# EAGLE design FoneAstra (EAGLE 7.2.0)
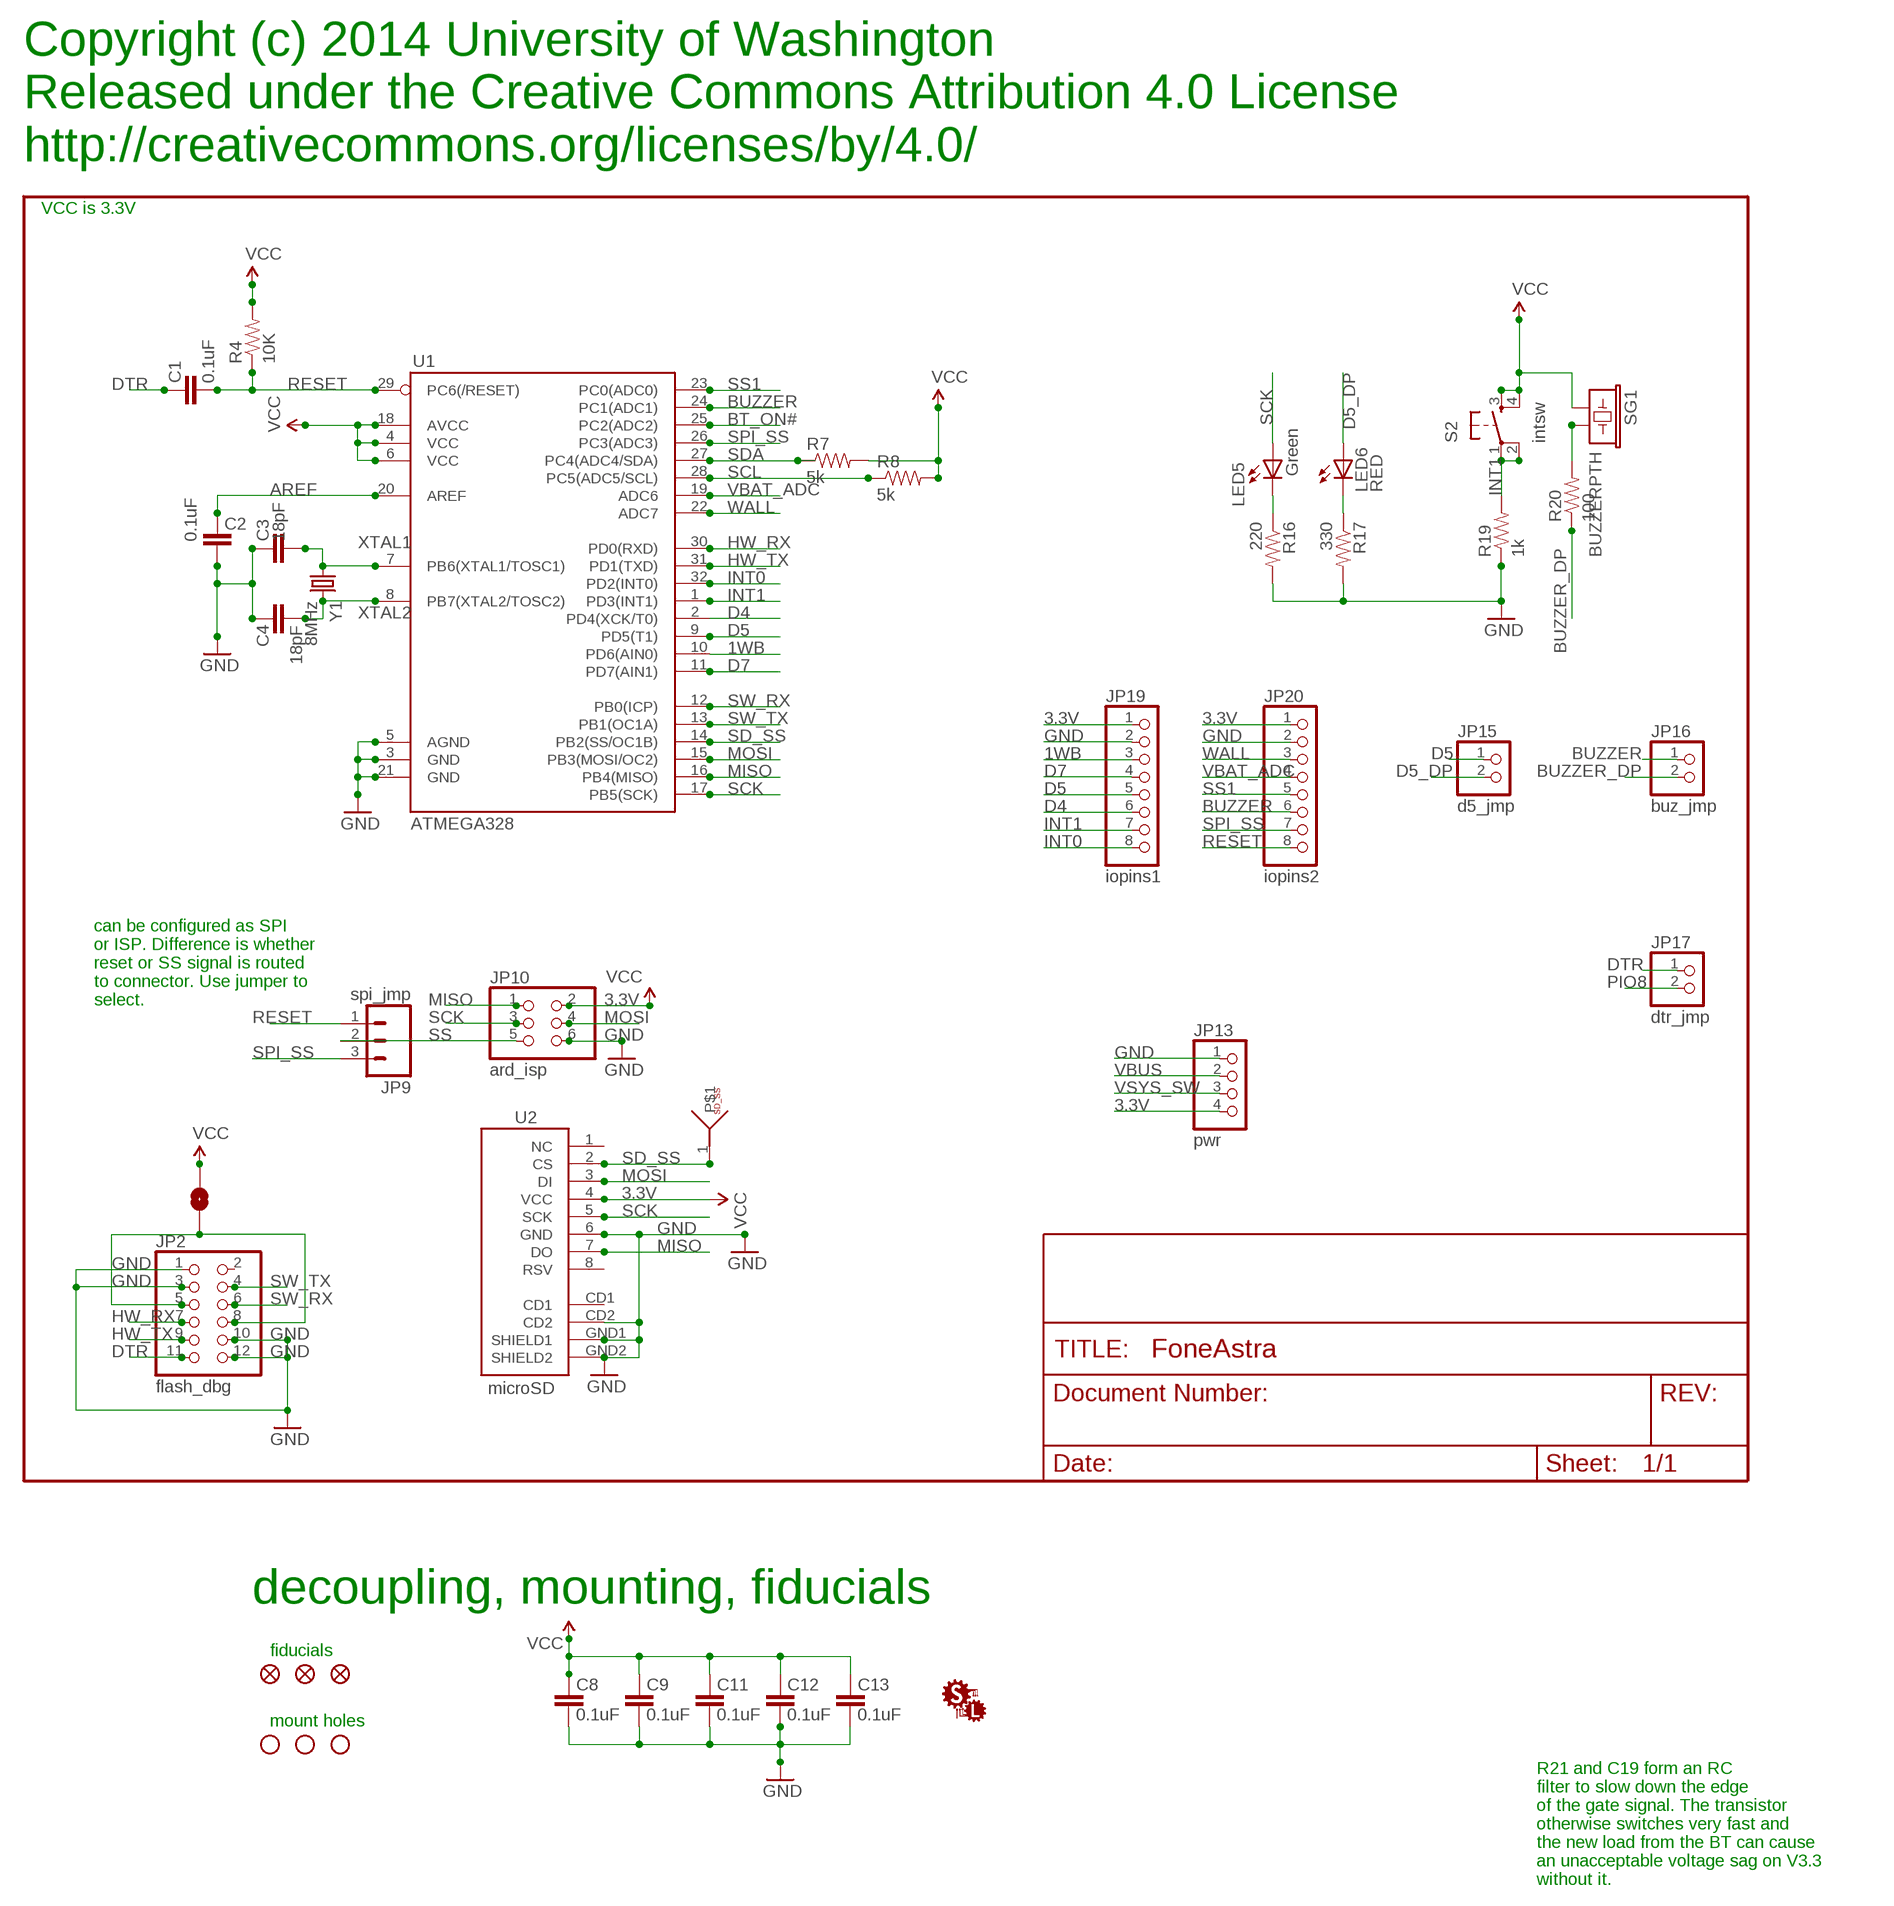
[diagram p0: schematic, sheet 1, part 1 of 2]
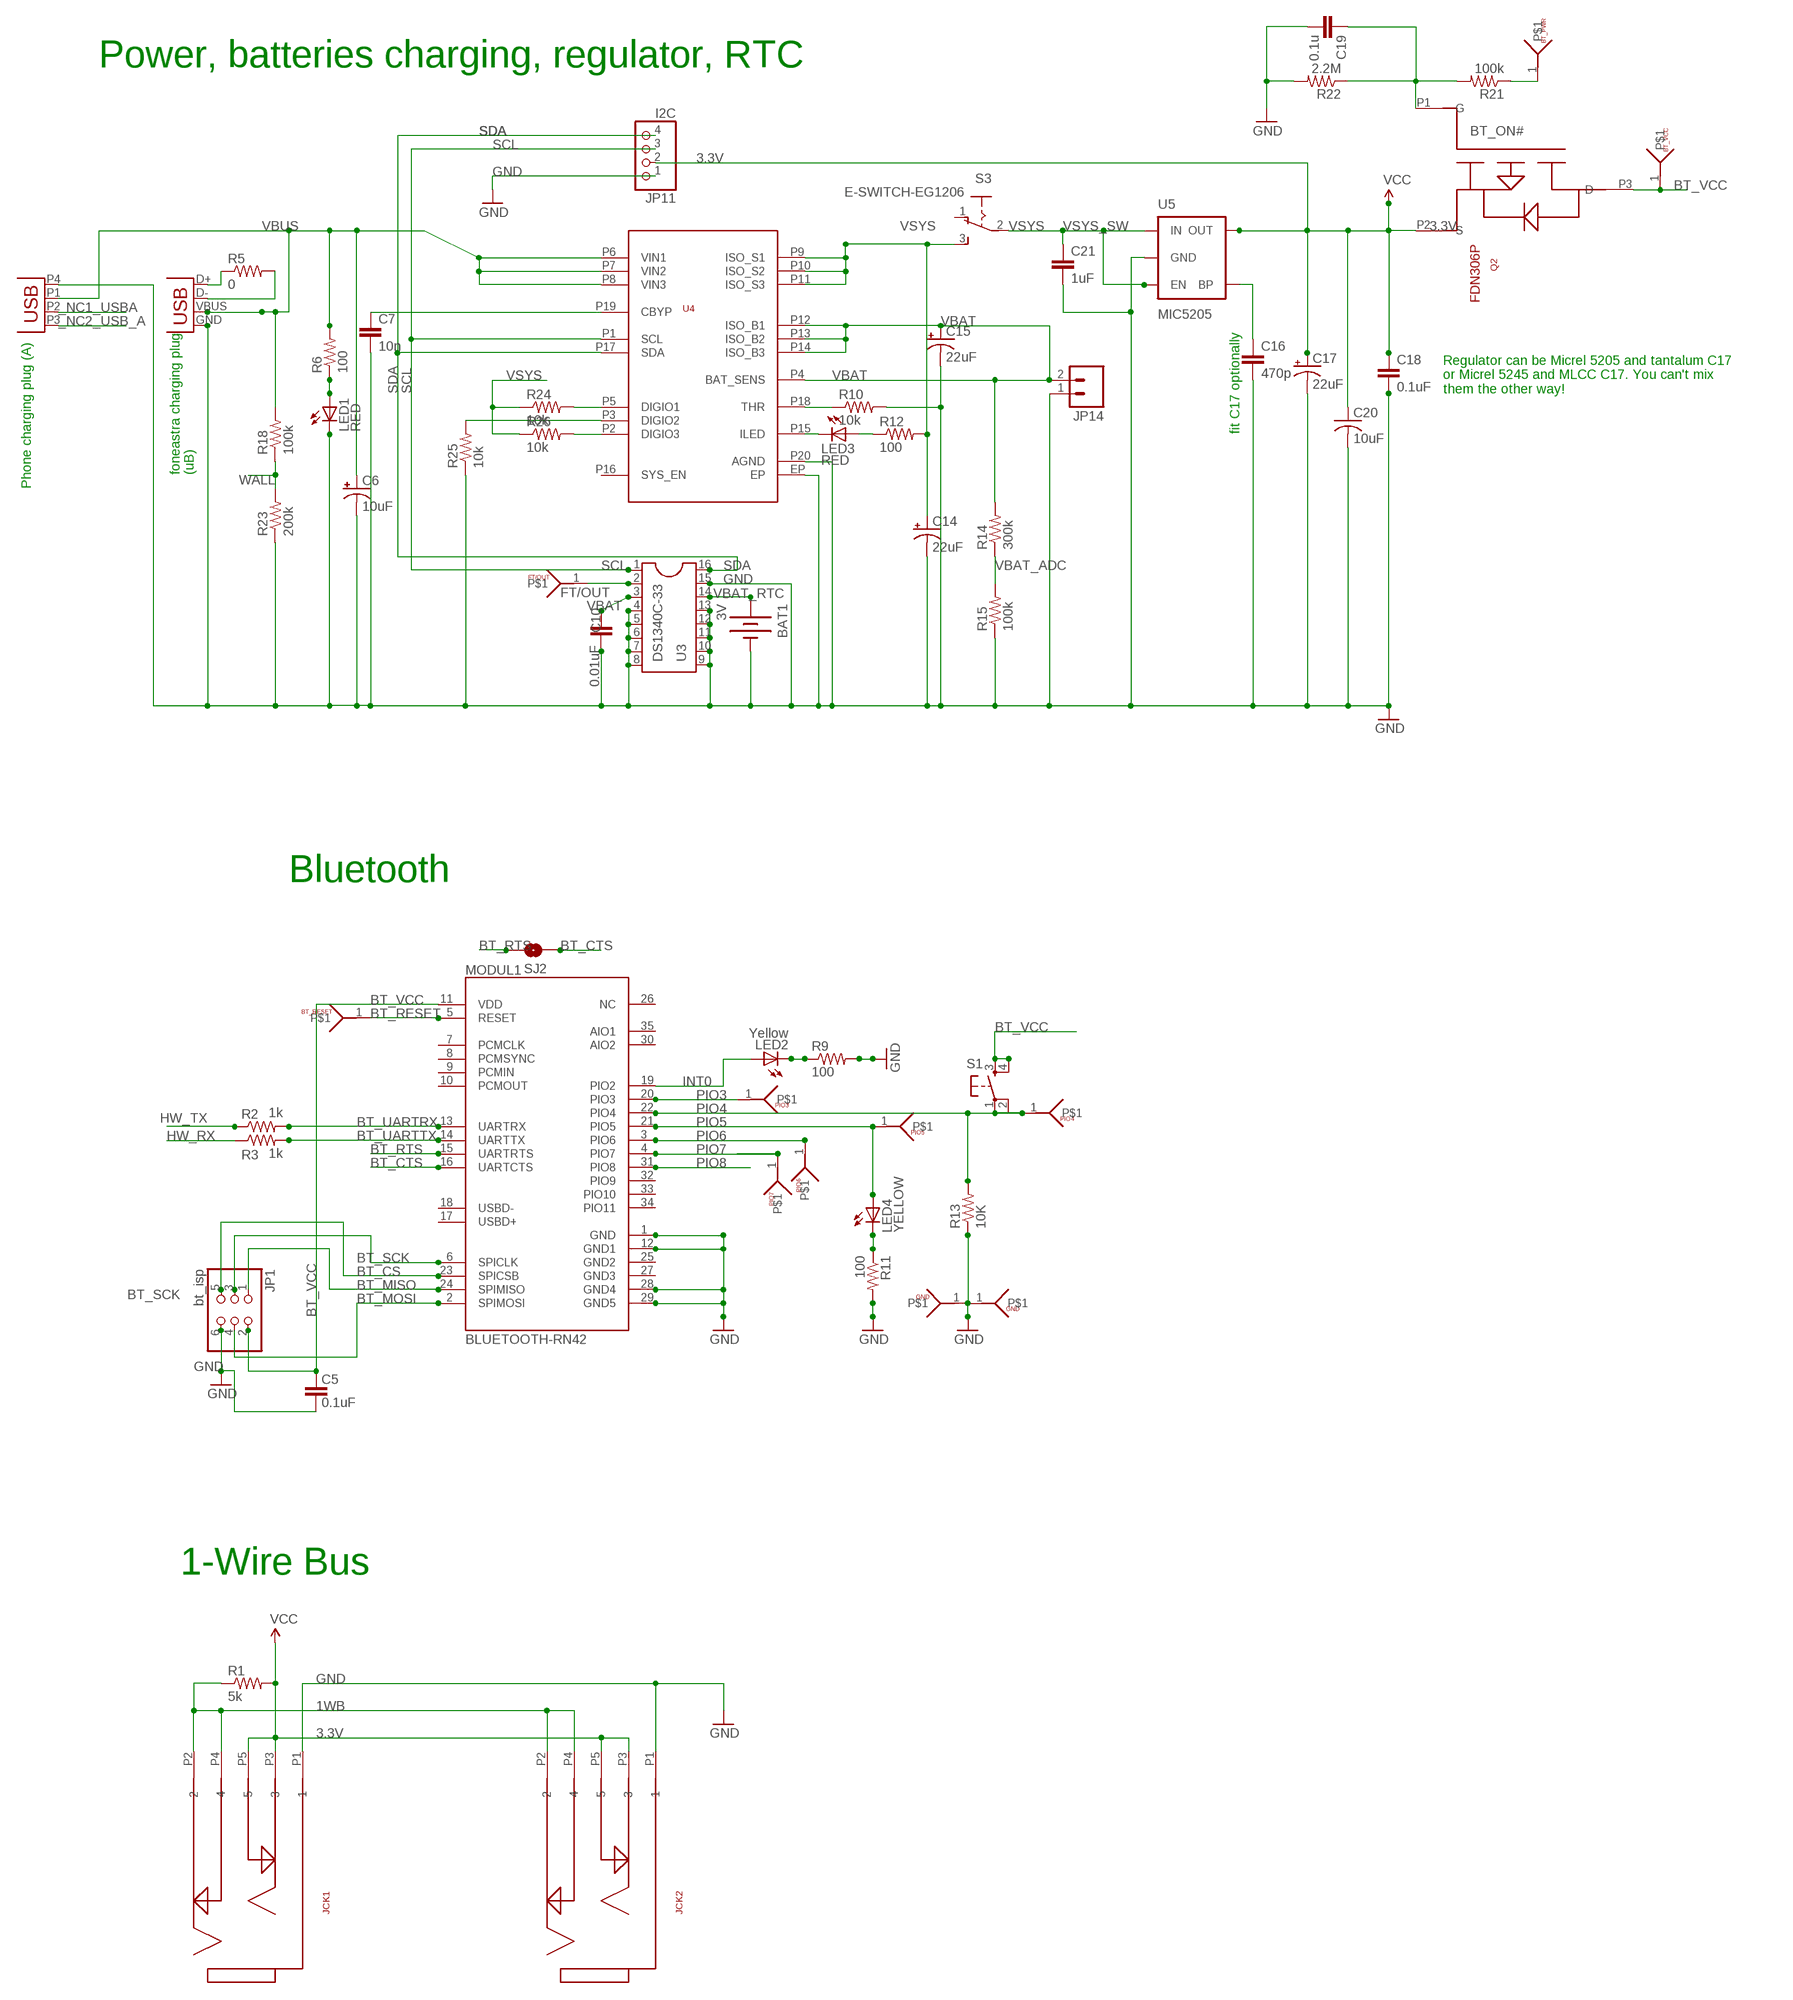
[diagram p1: schematic, sheet 1, part 2 of 2]

## Parts
BAT1  3V  BATTERY  [BATTCON_12MM_CURVED]
C1  0.1uF  CAP0402-CAP  [0402-CAP]
C2  0.1uF  CAP0402-CAP  [0402-CAP]
C3  18pF  CAP0402-CAP  [0402-CAP]
C4  18pF  CAP0402-CAP  [0402-CAP]
C5  0.1uF  CAP0402-CAP  [0402-CAP]
C6  10uF  CAP_POL1206  [EIA3216]
C7  10n  CAP0402-CAP  [0402-CAP]
C8  0.1uF  CAP0402-CAP  [0402-CAP]
C9  0.1uF  CAP0402-CAP  [0402-CAP]
C10  0.01uF  CAP0402-CAP  [0402-CAP]
C11  0.1uF  CAP0402-CAP  [0402-CAP]
C12  0.1uF  CAP0402-CAP  [0402-CAP]
C13  0.1uF  CAP0402-CAP  [0402-CAP]
C14  22uF  CAP_POL1206  [EIA3216]
C15  22uF  CAP_POL1206  [EIA3216]
C16  470p  CAP0402-CAP  [0402-CAP]
C17  22uF  CAP_POL1206  [EIA3216]
C18  0.1uF  CAP0402-CAP  [0402-CAP]
C19  0.1u  CAP0402-CAP  [0402-CAP]
C20  10uF  C-USC0805  [C0805]
C21  1uF  CAP0402-CAP  [0402-CAP]
JCK1  35RASMT4BHNTRX  [35RASMT4BHNTRX]
JCK2  35RASMT4BHNTRX  [35RASMT4BHNTRX]
JP1  bt_isp  PINHD-2X3  [2X03]
JP2  flash_dbg  PINHD-2X6  [2X06]
JP3  SPARKFUN_FIDUCIAL1.5X3  [SPARKFUN_FIDUCIAL-1.5X3]
JP4  STAND-OFFTIGHT  [STAND-OFF-TIGHT]
JP5  SPARKFUN_FIDUCIAL1.5X3  [SPARKFUN_FIDUCIAL-1.5X3]
JP6  STAND-OFFTIGHT  [STAND-OFF-TIGHT]
JP7  SPARKFUN_FIDUCIAL1.5X3  [SPARKFUN_FIDUCIAL-1.5X3]
JP8  STAND-OFFTIGHT  [STAND-OFF-TIGHT]
JP9  spi_jmp  M03PTH  [1X03]
JP10  ard_isp  PINHD-2X3  [2X03]
JP11  I2C  PINHD-1X4  [1X04]
JP13  pwr  PINHD-1X4  [1X04]
JP14  SPARKFUN_M02JST-PTH-2  [SPARKFUN_JST-2-PTH]
JP15  d5_jmp  PINHD-1X2  [1X02]
JP16  buz_jmp  PINHD-1X2  [1X02]
JP17  dtr_jmp  PINHD-1X2  [1X02]
JP19  iopins1  PINHD-1X8  [1X08]
JP20  iopins2  PINHD-1X8  [1X08]
LED1  RED  LED  [LXH4]
LED2  Yellow  LED  [LXH4]
LED3  RED  LED  [LXH4]
LED4  YELLOW  LED0603  [LED-0603]
LED5  Green  LED0603  [LED-0603]
LED6  RED  LED  [LXH4]
MODUL1  BLUETOOTH-RN42  SPARKFUN_BLUETOOTH-RN41"  [SPARKFUN_RN41]
Q2  FDN306P  [MYSOT23]
R1  5k  RESISTOR0402-RES  [0402-RES]
R2  1k  RESISTOR0402-RES  [0402-RES]
R3  1k  RESISTOR0402-RES  [0402-RES]
R4  10K  RESISTOR0402-RES  [0402-RES]
R5  0  RESISTOR0402-RES  [0402-RES]
R6  100  RESISTOR0402-RES  [0402-RES]
R7  5k  RESISTOR0402-RES  [0402-RES]
R8  5k  RESISTOR0402-RES  [0402-RES]
R9  100  RESISTOR0402-RES  [0402-RES]
R10  10k  RESISTOR0402-RES  [0402-RES]
R11  100  RESISTOR0402-RES  [0402-RES]
R12  100  RESISTOR0402-RES  [0402-RES]
R13  10K  RESISTOR0402-RES  [0402-RES]
R14  300k  RESISTOR0402-RES  [0402-RES]
R15  100k  RESISTOR0402-RES  [0402-RES]
R16  220  RESISTOR0402-RES  [0402-RES]
R17  330  RESISTOR0402-RES  [0402-RES]
R18  100k  RESISTOR0402-RES  [0402-RES]
R19  1k  RESISTOR0402-RES  [0402-RES]
R20  100  RESISTOR0402-RES  [0402-RES]
R21  100k  RESISTOR0402-RES  [0402-RES]
R22  2.2M  RESISTOR0402-RES  [0402-RES]
R23  200k  RESISTOR0402-RES  [0402-RES]
R24  10k  RESISTOR0402-RES  [0402-RES]
R25  10k  RESISTOR0402-RES  [0402-RES]
R26  10k  RESISTOR0402-RES  [0402-RES]
S1  Reset  TAC_SWITCHSMD  [TACTILE_SWITCH_SMD]
S2  intsw  SPARKFUN_TAC_SWITCHSMD  [SPARKFUN_TACTILE_SWITCH_SMD]
S3  E-SWITCH-EG1206  [EG1206]
SG1  BUZZERPTH  [BUZZER-12MM]
SJ1  SOLDERJUMPERNC2  [SJ_2S-NOTRACE]
SJ2  SOLDERJUMPERNC2  [SJ_2S-NOTRACE]
TP1  BT_RESET  TESTPOINT  [TESTPOINT]
TP2  FT/OUT  TESTPOINT  [TESTPOINT]
TP3  SD_SS  TESTPOINT  [TESTPOINT]
TP4  PIO3  TESTPOINT  [TESTPOINT]
TP5  PIO7  TESTPOINT  [TESTPOINT]
TP6  PIO6  TESTPOINT  [TESTPOINT]
TP7  PIO5  TESTPOINT  [TESTPOINT]
TP8  GND  TESTPOINT  [TESTPOINT]
TP9  GND  TESTPOINT  [TESTPOINT]
TP10  PIO4  TESTPOINT  [TESTPOINT]
TP11  BT_PWR  TESTPOINT  [TESTPOINT]
TP12  BT_VCC  TESTPOINT  [TESTPOINT]
U1  ATMEGA328  ATMEGA168  [TQFP32-08]
U2  microSD  SPARKFUN_USD-SOCKETSMD  [SPARKFUN_MICRO-SD-SOCKET-PP]
U3  DS1340C-33  [SO16L]
U4  ADP5062  [LFCSP_WQ20]
U5  MIC5205  V_REG_LDOSMD  [SOT23-5]
U$2  SHIFT_LOGO  [SHIFT_LOGO]
X1  MOLEX48204_USB_A_VERT  [MOLEX48204_USB_A_VERT]
X2  Micro USB  USB-MICROB  [USB-MICROB]
Y1  8MHz  CRYSTALHC49S  [HC49/S]

## Nets
1WB: JCK1.P2 JCK1.P4 JCK2.P2 JCK2.P4 JP19.3 R1.1 U1.10(PD6(AIN0))
3.3V [power]: C8.2 C9.2 C11.2 C12.2 C13.2 C17.A(+) C18.1 C20.1 JCK1.P3 JCK1.P5 JCK2.P3 JCK2.P5 JP10.2 JP11.2 JP13.4 JP19.1 JP20.1 Q2.P2(S) R1.2 R4.2 R7.2 R8.2 S2.3 S2.4 SG1.+ SJ1.1 U1.4(VCC) U1.6(VCC) U1.18(AVCC) U2.4(VCC) U5.5(OUT) ; supply symbol labelled VCC
_NC1_USBA: X1.P2(D-)
_NC2_USB_A: X1.P3(D+)
AREF: C2.2 U1.20(AREF)
BT_CS: JP1.5 MODUL1.23(SPICSB)
BT_CTS: MODUL1.16(UARTCTS) SJ2.1
BT_MISO: JP1.1 MODUL1.24(SPIMISO)
BT_MOSI: JP1.4 MODUL1.2(SPIMOSI)
BT_ON#: R21.1 TP11.1 U1.25(PC2(ADC2))
BT_ON_G: C19.1 Q2.P1(G) R21.2 R22.1
BT_RESET: MODUL1.5(RESET) TP1.1
BT_RTS: MODUL1.15(UARTRTS) SJ2.2
BT_SCK: JP1.3 MODUL1.6(SPICLK)
BT_UARTRX: MODUL1.13(UARTRX) R2.2
BT_UARTTX: MODUL1.14(UARTTX) R3.2
BT_VCC [power]: C5.2 JP1.2 MODUL1.11(VDD) Q2.P3(D) S1.3 S1.4 TP12.1
BUZZER: JP16.1 JP20.6 U1.24(PC1(ADC1))
BUZZER_DP: JP16.2 R20.1
CH_L1: LED3.A R12.1
CHG_L_2: LED3.K(C) U4.P15(ILED)
CHG_THR: R10.1 U4.P18(THR)
D1: LED4.C R11.1
D4: JP19.6 U1.2(PD4(XCK/T0))
D5: JP15.1 JP19.5 U1.9(PD5(T1))
D5_DP: JP15.2 LED6.A
D7: JP19.4 U1.11(PD7(AIN1))
DTR: C1.2 JP2.11 JP17.1
FT/OUT: TP2.1 U3.2
GND [power]: BAT1.GND(-) C2.1 C3.2 C4.2 C5.1 C6.C(-) C7.2 C8.1 C9.1 C10.1 C11.1 C12.1 C13.1 C14.C(-) C15.C(-) C16.2 C17.C(-) C18.2 C19.2 C20.2 C21.2 JCK1.P1 JCK2.P1 JP1.6 JP2.1 JP2.3 JP2.10 JP2.12 JP10.6 JP11.1 JP13.1 JP14.1 JP19.2 JP20.2 LED1.K(C) MODUL1.1(GND) MODUL1.12(GND1) MODUL1.28(GND4) MODUL1.29(GND5) R9.2 R10.2 R11.2 R13.1 R15.1 R16.2 R17.2 R19.1 R22.2 R23.1 R25.1 TP8.1 TP9.1 U1.3(GND) U1.5(AGND) U1.21(GND) U2.6(GND) U2.CD2 U2.GND1(SHIELD1) U2.GND2(SHIELD2) U3.4 U3.5 U3.6 U3.7 U3.8 U3.9 U3.10 U3.11 U3.12 U3.13 U3.15 U4.EP U4.P20(AGND) U5.2(GND) X1.P4(GND) X2.GND
HW_RX: JP2.7 R3.1 U1.30(PD0(RXD))
HW_TX: JP2.9 R2.1 U1.31(PD1(TXD))
INT0: JP19.8 LED2.A MODUL1.19(PIO2) U1.32(PD2(INT0))
INT1: JP19.7 R19.2 S2.1 S2.2 U1.1(PD3(INT1))
MISO: JP10.1 U1.16(PB4(MISO)) U2.7(DO)
MOSI: JP10.4 U1.15(PB3(MOSI/OC2)) U2.3(DI)
N$1: R20.2 SG1.-
N$2: JP2.5 JP2.8 SJ1.2
N$3: C7.1 U4.P19(CBYP)
N$4: R24.2 U4.P5(DIGIO1)
N$5: LED6.K(C) R17.1
N$6: R26.2 U4.P2(DIGIO3)
N$7: LED5.C R16.1
N$8: LED2.K(C) R9.1
N$9: LED1.A R6.1
N$10: C16.1 U5.4(BP)
N$11: R25.2 U4.P3(DIGIO2)
N$14: R5.2 X2.D-
N$16: R5.1 X2.D+
PIO3: MODUL1.20(PIO3) TP4.1
PIO4: MODUL1.22(PIO4) R13.2 S1.1 S1.2 TP10.1
PIO5: LED4.A MODUL1.21(PIO5) TP7.1
PIO6: MODUL1.3(PIO6) TP6.1
PIO7: MODUL1.4(PIO7) TP5.1
PIO8: JP17.2 MODUL1.31(PIO8)
RESET: C1.1 JP9.1 JP20.8 R4.1 U1.29(PC6(/RESET))
SCK: JP10.3 LED5.A U1.17(PB5(SCK)) U2.5(SCK)
SCL: JP11.3 R8.1 U1.28(PC5(ADC5/SCL)) U3.1 U4.P1(SCL)
SD_SS: TP3.1 U1.14(PB2(SS/OC1B)) U2.2(CS)
SDA: JP11.4 R7.1 U1.27(PC4(ADC4/SDA)) U3.16 U4.P17(SDA)
SPI_SS: JP9.3 JP20.7 U1.26(PC3(ADC3))
SS: JP9.2 JP10.5
SS1: JP20.5 U1.23(PC0(ADC0))
SW_RX: JP2.6 U1.12(PB0(ICP))
SW_TX: JP2.4 U1.13(PB1(OC1A))
VBAT: C10.2 C15.A(+) JP14.2 R14.2 U3.3 U4.P4(BAT_SENS) U4.P12(ISO_B1) U4.P13(ISO_B2) U4.P14(ISO_B3)
VBAT_ADC: JP20.4 R14.1 R15.2 U1.19(ADC6)
VBAT_RTC: BAT1.PWR@1(+) U3.14
VBUS [power]: C6.A(+) JP13.2 R6.2 R18.2 U4.P6(VIN1) U4.P7(VIN2) U4.P8(VIN3) X1.P1(VBUS) X2.VBUS
VSYS [power]: C14.A(+) R12.2 R24.1 R26.1 S3.3(S) U4.P9(ISO_S1) U4.P10(ISO_S2) U4.P11(ISO_S3)
VSYS_SW [power]: C21.1 JP13.3 S3.2(P) U5.1(IN) U5.3(EN)
WALL: JP20.3 R18.1 R23.2 U1.22(ADC7)
XTAL1: C3.1 U1.7(PB6(XTAL1/TOSC1)) Y1.1
XTAL2: C4.1 U1.8(PB7(XTAL2/TOSC2)) Y1.2
Unconnected: JP2.2 MODUL1.7(PCMCLK) MODUL1.8(PCMSYNC) MODUL1.9(PCMIN) MODUL1.10(PCMOUT) MODUL1.17(USBD+) MODUL1.18(USBD-) MODUL1.25(GND2) MODUL1.26(NC) MODUL1.27(GND3) MODUL1.30(AIO2) MODUL1.32(PIO9) MODUL1.33(PIO10) MODUL1.34(PIO11) MODUL1.35(AIO1) S3.1(O) U2.1(NC) U2.8(RSV) U2.CD1 U4.P16(SYS_EN)

## Notes on the sheet
- Copyright (c) 2014 University of Washington
  Released under the Creative Commons Attribution 4.0 License
  http://creativecommons.org/licenses/by/4.0/
- VCC is 3.3V
- can be configured as SPI
  or ISP. Difference is whether
  reset or SS signal is routed 
  to connector. Use jumper to
  select.
- decoupling, mounting, fiducials
- fiducials
- mount holes
- R21 and C19 form an RC
  filter to slow down the edge
  of the gate signal. The transistor
  otherwise switches very fast and
  the new load from the BT can cause
  an unacceptable voltage sag on V3.3
  without it.
- Power, batteries charging, regulator, RTC
- Regulator can be Micrel 5205 and tantalum C17
  or Micrel 5245 and MLCC C17. You can't mix
  them the other way!
- fit C17 optionally
- foneastra charging plug
  (uB)
- Phone charging plug (A)
- Bluetooth
- 1-Wire Bus

## Library data of the parts
BAT1 = SparkFun:BATTERY: Battery Holders Various common sizes : AA, AAA, 20mm coin cell and 12mm coin cell.
C1-C5 C7-C13 C16 C18 C19 C21 = SparkFun:CAP: Capacitor Standard 0603 ceramic capacitor, and 0.1" leaded capacitor.
C6 C14 C15 C17 = SparkFun:CAP_POL: Capacitor Polarized These are standard SMD and PTH capacitors. Normally 10uF, 47uF, and 100uF in electrolytic and tantalum varieties. Always verify the external diameter of the through hole cap, it varies with capacity, voltage, and manufacturer. The EIA devices should be standard.
C20 = resistor:C-US: CAPACITOR, American symbol
JCK1 JCK2 = FoneAstra3.2c:35RASMT4BHNTRX
JP1 JP10 = pinhead:PINHD-2X3: PIN HEADER
JP2 = pinhead:PINHD-2X6: PIN HEADER
JP3 JP5 JP7 = FoneAstra3.0_v2:SPARKFUN_FIDUCIAL: Fiducial Alignment Points Various fiducial points for machine vision alignment.
JP4 JP6 JP8 = SparkFun-Electromechanical:STAND-OFF: #4 Stand Off This is the mechanical footprint for a #4 phillips button head screw. Use the keepout ring to avoid running the screw head into surrounding components. SKU : PRT-00447
JP9 = FoneAstra:M03: Header 3 Standard 3-pin 0.1" header. Use with straight break away headers (SKU : PRT-00116), right angle break away headers (PRT-00553), swiss pins (PRT-00743), machine pins (PRT-00117), and female headers (PRT-00115). Molex polarized connector foot print use with SKU : PRT-08232 with associated crimp pins and housings.
JP11 JP13 = FoneAstra:PINHD-1X4: PIN HEADER
JP14 = FoneAstra3.2c:SPARKFUN_M02: Header 2 Standard 2-pin 0.1" header. Use with straight break away headers (SKU : PRT-00116), right angle break away headers (PRT-00553), swiss pins (PRT-00743), machine pins (PRT-00117), and female headers (PRT-00115). Molex polarized connector foot print use with SKU : PRT-08233 with associated crimp pins and housings.
JP15-JP17 = FoneAstra:PINHD-1X2: PIN HEADER
JP19 JP20 = pinhead:PINHD-1X8: PIN HEADER
LED1-LED3 LED6 = FoneAstra3.2c:LED
LED4 LED5 = SparkFun:LED: LEDs Standard schematic elements and footprints for 5mm, 3mm, 1206, and 0603 sized LEDs. 5mm - Spark Fun Electronics SKU : COM-00529 (and others)
MODUL1 = FoneAstra3.2c:SPARKFUN_BLUETOOTH-RN41
Q2 = FoneAstra3.2c:FDN306P
R1-R26 = SparkFun:RESISTOR: Resistor Basic schematic elements and footprints for 0603, 1206, and PTH resistors.
S1 = SparkFun:TAC_SWITCH: Momentary Switch Button commonly used for reset or general input. Spark Fun Electronics SKU : COM-00097
S2 = FoneAstra3.2b:SPARKFUN_TAC_SWITCH: Momentary Switch Button commonly used for reset or general input. Spark Fun Electronics SKU : COM-00097
S3 = FoneAstra3.2c:E-SWITCH-EG1206
SG1 = SparkFun-Electromechanical:BUZZER: Buzzer 12mm Spark Fun Electronics SKU : Comp-Buzzer
SJ1 SJ2 = SparkFun:SOLDERJUMPER: Solder Jumper Standard SMD solder jumper. Used to automate production. Two varients : Normally Open and Normally Closed are the same, but have different paste layers. NC will have a large amount of paste and should jumper during reflow.
TP1-TP12 = FoneAstra3.0_v3:TESTPOINT
U1 = SparkFun:ATMEGA168
U2 = FoneAstra3.2c:SPARKFUN_USD-SOCKET: microSD Socket Push-push type uSD socket. Schematic element and footprint production proven. Spark Fun Electronics SKU : PRT-00127. tDoc lines correctly indicate media card edge positions when inserting (unlocked, locked, depressed).
U3 = FoneAstra3.2c:DS1340C-33
U4 = FoneAstra3.2c:ADP5062
U5 = SparkFun:V_REG_LDO: Voltage Regulator LDO Standard 150mA LDO voltage regulator in SOT-23 layout. Micrel part MIC5205. BP (by-pass) pin is used to lower output noise with 470pF cap.
U$2 = FoneAstra3.2c:SHIFT_LOGO
X1 = FoneAstra3.2c:MOLEX48204_USB_A_VERT
X2 = SparkFun:USB: USB Connectors USB-B-PTH is fully proven SKU : PRT-00139 USB-miniB is fully proven SKU : PRT-00587 USB-A-PCB is untested. USB-A-H is throughly reviewed, but untested. Spark Fun Electronics SKU : PRT-00437 USB-B-SMT is throughly reviewed, but untested. Needs silkscreen touching up. USB-A-S has not been used/tested USB-MB-H has not been used/tested
Y1 = crystal:CRYSTAL: CRYSTAL; OC_FARNELL: 1667008; OC_NEWARK: unknown

## Net classes
0 default: width 0.178 mm, clearance 0.178 mm
1 power: width 0.305 mm, clearance 0.178 mm

## Board
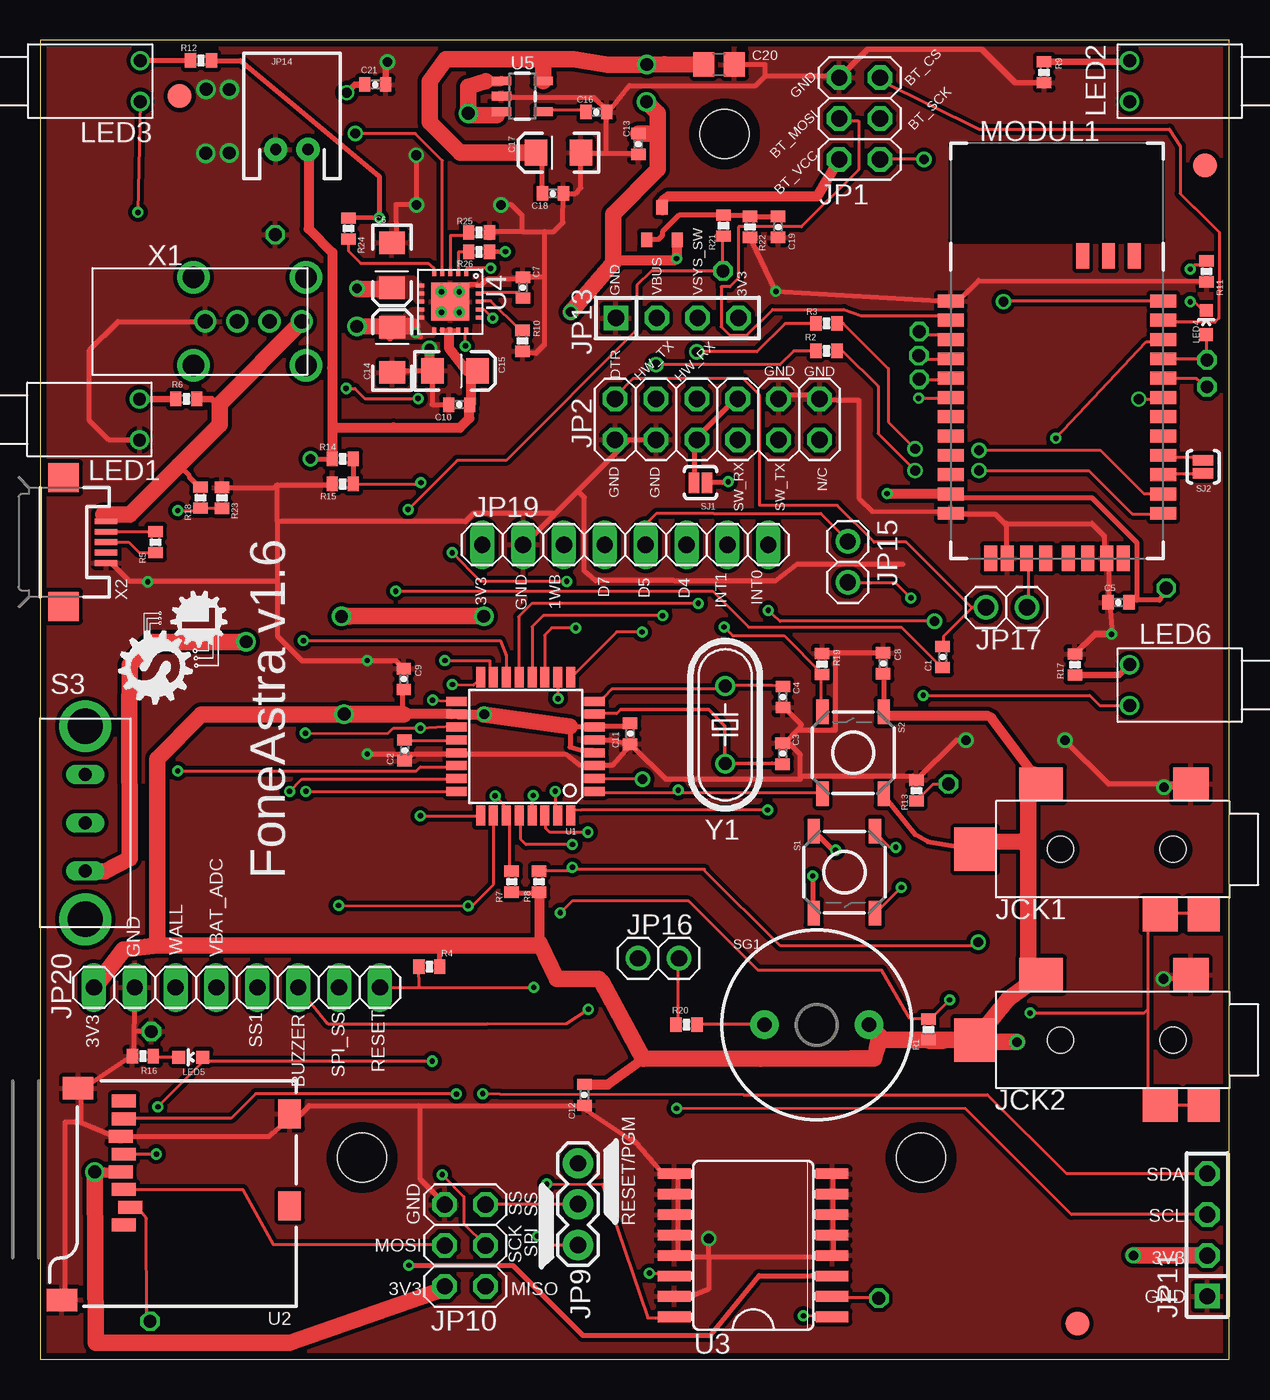
[diagram p2: board, top side]
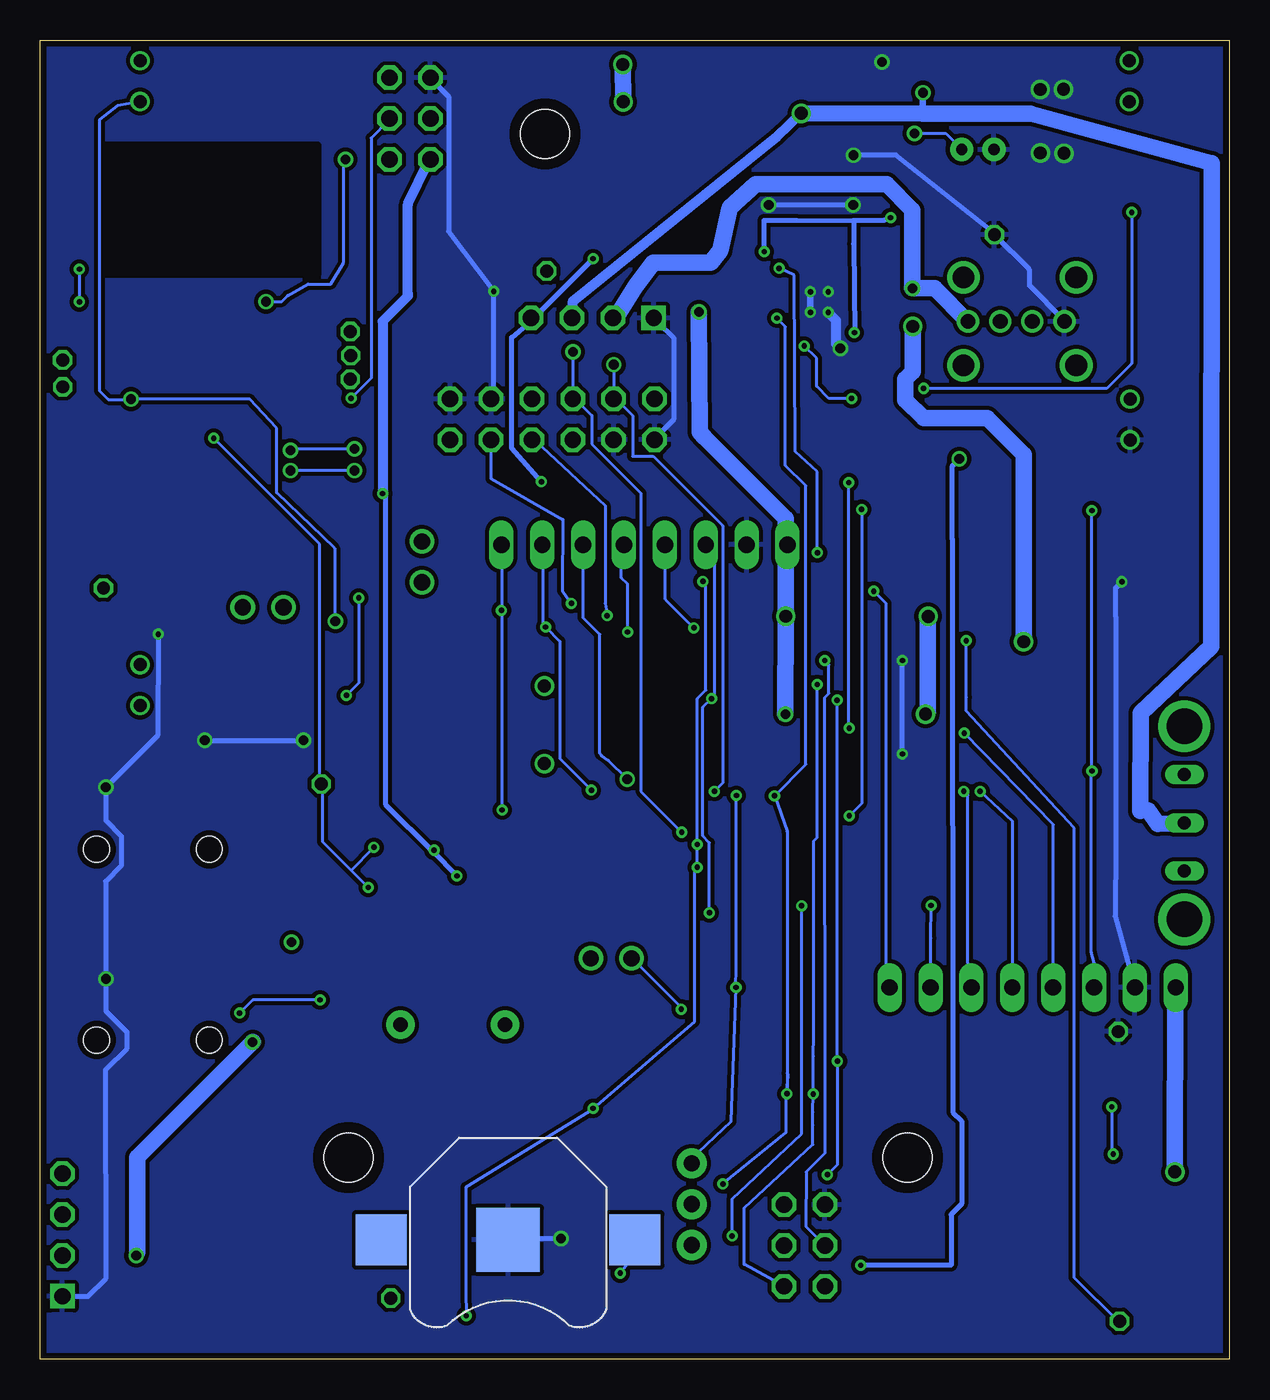
[diagram p3: board, bottom side, seen from below]

Size 73.9 x 82 mm. Coordinates in mm from the lower left corner, seen from the top.
Outline: 0,0 73.9,0 73.9,82 0,82 0,0
Copper layers (1*16): Top 0.0356mm / dielectric 1.5011mm / Bottom 0.0356mm
Design rules "LaenPCBOrder *": minimum track width 6mil, minimum drill 13mil, track to track 6mil, track to pad 6mil, pad to pad 6mil, via to via 6mil, smd to smd 6mil, copper to edge 15mil, drill to drill 6mil, minimum pad ring 7mil, minimum via ring 7mil, stop-mask expansion 3mil, vias tented up to drill 14mil, thermal gap 10mil
tRestrict: area 56.7,69.6 to 69.7,75.5
bRestrict: area 56.7,67.5 to 69.7,75.5

### Footprints (pad centres in the part's own frame; a part is rotated, then mirrored left to right if it is on the bottom)
BATTCON_12MM_CURVED = smd 3.962 x 3.962: GND 0,0 | smd 3.175 x 3.175: PWR@1 -7.874,0; PWR@2 7.874,0
0402-CAP = smd 0.7 x 0.9: 1 -0.65,0; 2 0.65,0
EIA3216 = smd 1.4 x 1.6: A 1.4,0; C -1.4,0
C0805 = smd 1.3 x 1.5: 1 -0.95,0; 2 0.95,0
35RASMT4BHNTRX = smd 2.2 x 2.1: P1 -4.5,-4.05; P2 -2.6,4.05 | smd 2.7 x 2.1: P3 4.8,-4.05 | smd 2 x 2.1: P4 -5.3,4.05 | smd 2.6 x 2.7: P5 8.9,0 | hole 1.6: -3.4,0; 3.6,0
2X03 = drill 1.016 octagon: 1 -2.54,-1.27; 2 -2.54,1.27; 3 0,-1.27; 4 0,1.27; 5 2.54,-1.27; 6 2.54,1.27
2X06 = drill 1.016 octagon: 1 -6.35,-1.27; 2 -6.35,1.27; 3 -3.81,-1.27; 4 -3.81,1.27; 5 -1.27,-1.27; 6 -1.27,1.27; 7 1.27,-1.27; 8 1.27,1.27; 9 3.81,-1.27; 10 3.81,1.27; 11 6.35,-1.27; 12 6.35,1.27
SPARKFUN_FIDUCIAL-1.5X3 = smd 1.5 x 1.5: 1 0,0
STAND-OFF-TIGHT = hole 3.048: 0,0
1X03 = drill 1.016 pad 1.88: 1 0,0; 2 2.54,0; 3 5.08,0
1X04 = drill 1.016 square: 1 -3.81,0 | drill 1.016 octagon: 2 -1.27,0; 3 1.27,0; 4 3.81,0
SPARKFUN_JST-2-PTH = drill 0.7 pad 1.448: 1 -1,0; 2 1,0
1X02 = drill 1.016: 1 -1.27,0; 2 1.27,0
1X08 = drill 1.016 long: 1 -8.89,0; 2 -6.35,0; 3 -3.81,0; 4 -1.27,0; 5 1.27,0; 6 3.81,0; 7 6.35,0; 8 8.89,0
LXH4 = drill 0.8: A -1.27,-0.73; K 1.27,-0.73
LED-0603 = smd 0.8 x 0.8: A 0,-0.75; C 0,0.75
SPARKFUN_RN41 = smd 0.8 x 1.6: 1 -6.6,-6.6; 2 -5.4,-6.6; 3 -4.2,-6.6; 4 -3,-6.6; 5 -1.8,-6.6; 6 -0.6,-6.6; 7 0.6,-6.6; 8 1.8,-6.6; 9 3,-6.6; 10 4.2,-6.6; 11 5.4,-6.6; 12 6.6,-6.6; 13 6.6,6.6; 14 5.4,6.6; 15 4.2,6.6; 16 3,6.6; 17 1.8,6.6; 18 0.6,6.6; 19 -0.6,6.6; 20 -1.8,6.6; 21 -3,6.6; 22 -4.2,6.6; 23 -5.4,6.6; 24 -6.6,6.6 | smd 1.6 x 0.8: 25 -9.4,4.8; 26 -9.4,3.2; 27 -9.4,1.6; 28 9.4,3.1; 29 9.4,-3.1; 30 9.4,-4.122; 31 9.4,-1.9; 32 9.4,-0.7; 33 9.4,0.7; 34 9.4,1.9; 35 9.4,4.122
MYSOT23 = smd 0.7 x 0.9: P1 -0.95,0; P2 0.95,0; P3 0,2
0402-RES = smd 0.7 x 0.9: 1 -0.65,0; 2 0.65,0
TACTILE_SWITCH_SMD = smd 1.524 x 0.762: 1 -2.54,1.905; 2 2.54,1.905; 3 -2.54,-1.905; 4 2.54,-1.905
SPARKFUN_TACTILE_SWITCH_SMD = smd 1.524 x 0.762: 1 -2.54,1.905; 2 2.54,1.905; 3 -2.54,-1.905; 4 2.54,-1.905
EG1206 = drill 0.8 long: 1 0,0; 2 3,0; 3 6,0 | drill 2.2 pad 2.54: P$4 -3,0; P$5 9,0
BUZZER-12MM = drill 0.9 pad 1.778: + 3.25,0; - -3.25,0
SJ_2S-NOTRACE = smd 0.635 x 1.27: 1 -0.401,0; 2 0.413,0
TESTPOINT = drill 0.8 octagon: 1 0,0
TQFP32-08 = smd 1.27 x 0.559: 1 -4.293,2.8; 2 -4.293,2; 3 -4.293,1.2; 4 -4.293,0.4; 5 -4.293,-0.4; 6 -4.293,-1.2; 7 -4.293,-2; 8 -4.293,-2.8; 17 4.293,-2.8; 18 4.293,-2; 19 4.293,-1.2; 20 4.293,-0.4; 21 4.293,0.4; 22 4.293,1.2; 23 4.293,2; 24 4.293,2.8 | smd 0.559 x 1.27: 9 -2.8,-4.293; 10 -2,-4.293; 11 -1.2,-4.293; 12 -0.4,-4.293; 13 0.4,-4.293; 14 1.2,-4.293; 15 2,-4.293; 16 2.8,-4.293; 25 2.8,4.293; 26 2,4.293; 27 1.2,4.293; 28 0.4,4.293; 29 -0.4,4.293; 30 -1.2,4.293; 31 -2,4.293; 32 -2.8,4.293
SPARKFUN_MICRO-SD-SOCKET-PP = smd 0.8 x 1.5: 1 -1.94,4.5; 2 -0.84,4.1; 3 0.26,4.5; 4 1.36,4.7; 5 2.46,4.5; 6 3.56,4.7; 7 4.66,4.5; 8 5.76,4.5 | smd 1.8 x 1.4: CD1 -0.75,-5.8; CD2 4.95,-5.8 | smd 1.4 x 1.9: GND1 -6.6,8.35; GND2 6.55,7.35
SO16L = smd 0.66 x 2.032: 1 -4.445,-4.902; 2 -3.175,-4.902; 3 -1.905,-4.902; 4 -0.635,-4.902; 5 0.635,-4.902; 6 1.905,-4.902; 7 3.175,-4.902; 8 4.445,-4.902; 9 4.445,4.902; 10 3.175,4.902; 11 1.905,4.902; 12 0.635,4.902; 13 -0.635,4.902; 14 -1.905,4.902; 15 -3.175,4.902; 16 -4.445,4.902
LFCSP_WQ20 = smd 2.35 x 2.35: EP 0,0 | smd 0.4 x 0.25: P1 -1.8,1; P2 -1.8,0.5; P3 -1.8,0; P4 -1.8,-0.5; P5 -1.8,-1; P11 1.8,-1; P12 1.8,-0.5; P13 1.8,0; P14 1.8,0.5; P15 1.8,1 | smd 0.25 x 0.4: P6 -1,-1.8; P7 -0.5,-1.8; P8 0,-1.8; P9 0.5,-1.8; P10 1,-1.8; P16 1,1.8; P17 0.5,1.8; P18 0,1.8; P19 -0.5,1.8; P20 -1,1.8
SOT23-5 = smd 0.55 x 1.2: 1 -0.95,-1.3; 2 0,-1.3; 3 0.95,-1.3; 4 0.95,1.3; 5 -0.95,1.3
MOLEX48204_USB_A_VERT = drill 1.35: MT2 2.735,-0.73; MT3 2.735,6.27; MT4 -2.735,6.27; PT1 -2.735,-0.73 | drill 0.92: P1 0,6; P2 0,4; P3 0,2; P4 0,0
USB-MICROB = smd 0.35 x 1.4: D+ 0,2.65; D- -0.65,2.65; GND 1.3,2.65; ID 0.65,2.65; VBUS -1.3,2.65 | smd 1.8 x 1.9: MT1 -4,0; MT2 4,0
HC49/S = drill 0.813: 1 -2.413,0; 2 2.413,0

### Placement (x,y rotation side)
BAT1  44.82,7.43 180 bottom
C1  56.08,43.66 90 top
C2  22.65,37.85 90 top
C3  46.13,37.65 90 top
C4  46.14,41.17 270 top
C5  67,47.05 0 top
C6  21.85,68 270 top
C7  30,66.61 90 top
C8  52.39,43.27 270 top
C9  22.59,42.28 270 top
C10  26.04,59.34 0 top
C11  36.65,38.89 90 top
C12  33.82,16.43 90 top
C13  37.17,75.55 90 top
C14  21.87,62.74 90 top
C15  25.77,61.45 0 top
C16  34.56,77.53 0 top
C17  32.2,75.01 180 top
C18  31.86,72.47 0 top
C19  45.85,70.39 270 top
C20  42.18,80.49 0 top
C21  20.82,79.25 0 top
JCK1  67,31.7 180 top
JCK2  67,19.85 180 top
JP1  50.92,77.13 90 top
JP2  42.08,58.44 180 top
JP3  8.66,78.53 0 top
JP4  42.53,76.18 0 top
JP5  64.45,2.22 0 top
JP6  20,12.54 0 top
JP7  72.39,74.22 0 top
JP8  54.74,12.54 0 top
JP9  33.42,12.18 270 top
JP10  26.41,7.08 90 top
JP11  72.52,7.73 90 top
JP13  39.59,64.73 0 top
JP14  15.64,75.2 0 top
JP15  50.19,49.57 270 top
JP16  38.42,24.92 0 top
JP17  60.04,46.74 0 top
JP19  36.35,50.64 0 top
JP20  12.22,23.11 0 top
LED1  6.9,58.42 270 top
LED2  66.97,79.46 90 top
LED3  6.95,79.46 270 top
LED4  72.46,64.46 0 top
LED5  9.36,18.77 90 top
LED6  66.97,41.91 90 top
MODUL1  63.19,59.19 270 top
Q2  38.64,69.59 0 top
R1  55.2,20.5 270 top
R2  48.87,62.69 0 top
R3  48.87,64.39 0 top
R4  24.18,24.41 0 top
R5  7.17,50.8 90 top
R6  9.08,59.69 0 top
R7  29.3,29.69 270 top
R8  31,29.69 270 top
R9  62.39,80.01 270 top
R10  29.97,63.31 270 top
R11  72.48,67.62 270 top
R12  9.99,80.74 0 top
R13  54.44,35.35 270 top
R14  18.8,55.96 180 top
R15  18.8,54.41 0 top
R16  6.38,18.84 180 top
R17  64.29,43.19 90 top
R18  9.95,53.57 90 top
R19  48.59,43.22 270 top
R20  40.16,20.8 0 top
R21  42.46,70.47 90 top
R22  44.11,70.39 270 top
R23  11.29,53.55 270 top
R24  19.15,70.29 270 top
R25  27.27,70.05 180 top
R26  27.27,68.84 180 top
S1  49.98,30.28 270 top
S2  50.52,37.7 90 top
S3  2.8,36.35 270 top
SG1  48.26,20.8 0 top
SJ1  41.03,54.5 180 top
SJ2  72.27,55.48 270 top
TP1  54.63,60.92 270 top
TP2  52.12,3.8 0 top
TP3  6.82,2.36 0 top
TP4  72.5,60.45 270 top
TP5  54.6,62.39 270 top
TP6  54.63,63.89 270 top
TP7  72.51,62.12 270 top
TP8  6.91,20.37 270 top
TP9  14.6,69.91 0 top
TP10  56.44,35.77 270 top
TP11  42.43,67.65 0 top
TP12  69.97,47.94 270 top
U1  30.16,38.1 180 top
U2  9.7,10.29 90 top
U3  44.31,7.09 90 top
U4  25.47,65.75 270 top
U5  29.96,78.51 270 top
U$2  12.45,40.15 90 top
X1  10.25,64.52 270 top
X2  1.45,50.8 270 top
Y1  42.57,39.45 90 top

### Tracks (layer width: path | path; a pad name or v marks a point on that pad's centre or on a via)
1WB  (via drill 0.33)
  Top 0.178: v32.18,41.07 32.18,42.32 U1.10 | JCK2.P4 71.65,15.82 69.16,15.82 JCK2.P2 68.83,15.91 68.83,21.75 | JCK1.P4 71.65,27.74 69.16,27.74 JCK1.P2 68.99,27.56 68.82,27.42 68.83,21.75 | 54.03,21.2 55.23,21.18 R1.1 | 54.03,21.2 53.89,21.45 52.3,24.18 44.61,24.18 40.3,28.49 33.05,28.49 v32.32,27.76 | 54.03,21.2 55.37,21.2 v56.51,22.34 | v61.51,21.52 68.6,21.52 68.83,21.75
  Bottom 0.178: JP19.3 32.54,50.49 32,49.96 32,41.25 v32.18,41.07 32.72,40.54 32.72,32.54 32.32,32.11 v32.32,27.76 | v56.51,22.34 60.69,22.34 v61.51,21.52
3.3V  (via drill 0.33, 0.6, 0.8)
  Top 0.305: C11.2 36.58,39.37 34.54,39.37 U1.6 34.31,39.29 32.93,39.29 32.93,38.05 33.6,37.87 34.31,37.87 U1.4 | 31.66,79.47 U5.5 | 30.73,75.22 C17.A | 39.37,68.33 39.61,68.5 v39.55,68.42 39.59,68.42 | 4.93,11.61 5.08,11.43 U2.4 | 3.39,11.63 3.92,11.62 | 24.95,4.31 JP10.2 | 27.69,50.55 JP19.1 | 29.21,28.96 R7.2 29.46,28.96 31.24,28.96 R8.2 31.05,28.97 | C8.2 52.45,42.49 52.45,40.36 S2.4 52.45,40.18 52.63,40.01 | S2.3 52.45,35.03 54.4,32.6 55.14,32.2 JCK1.P5 | 58.85,40.01 59.1,39.88 | 61.38,24.24 JCK2.P3 | C9.2 22.52,41.6 22.52,40.1 22.58,40.08 | 25.54,40.1 U1.18 25.96,40.08 | C18.1 31.15,72.54 31.15,74.85 30.94,74.85 C17.A | 35.63,68.22 35.6,68.33 | 3.38,23.11 JP20.1 | v42.75,54.55 42.7,54.5 SJ1.1 | R4.2 24.83,25.69 24.89,25.74 | 30.96,25.74 31.01,25.79 | 38.37,76.2 38.38,76.19 | C17.A | 31.32,80.81 31.32,80.8 | 31.26,80.7 31.15,80.8 | 57.61,19.72 57.49,19.85
  Top 0.61: 35.6,68.33 39.37,68.33 | 4.93,11.61 3.92,11.62 v3.39,11.64 | 37.56,18.72 37.49,18.68 35.27,17.09 C12.2 33.82,17.1 33.81,17.1 | 39.59,68.42 Q2.P2 | JCK2.P5 57.49,19.85 57.28,19.85 57.28,19.86 | JCK1.P5 58.07,32.16 | JCK1.P3 61.76,36.34 59.1,39.88 59.05,39.93 | 58.85,40.01 52.63,40.01 | 25.54,40.1 22.52,40.1 | 32.9,39.33 32.93,39.29 | 25.96,40.08 27.56,40.08 v27.59,40.1 | 31.05,28.97 31.05,25.87 31.01,25.79 | 34.69,23.65 34.89,23.45 | 44.73,18.71 44.79,18.69
  Top 1.016: 35.6,68.33 35.61,70.11 35.61,71.19 38.38,73.97 38.38,76.19 38.38,77.46 v37.67,78.17 | 3.39,11.63 3.45,1.02 15.49,1.02 24.95,4.31 | 37.56,18.72 44.79,18.69 50.41,18.71 51.82,18.72 51.98,19.28 52.12,19.85 52.41,19.85 | 34.89,23.45 37.49,18.68 | JCK2.P3 60.16,22.4 JCK2.P5 | 27.56,40.08 32.9,39.33 | v32.97,65.11 35.63,68.22 | 31.05,25.87 32.11,23.64 34.69,23.65 | 3.38,23.11 5.17,25.47 7.27,25.74 | 19.1,40.08 14.34,40.08 9.99,40.07 7.26,37.33 7.27,25.74 | 19.1,40.08 22.58,40.08 | 57.28,19.86 56.18,19.86 56.1,19.78 55.27,19.78 R1.2 | 57.28,19.85 52.41,19.85 | SG1.+ 51.58,20.73 51.58,20.68 52.41,19.85 | JCK1.P3 | 18.81,40.06 18.81,40.03 v18.88,40.1 | 22.52,40.1 v18.88,40.1 | 19.24,46.19 v27.57,46.19 | 19.24,46.19 18.69,46.19 | v18.88,40.1 19.08,40.1 19.1,40.08 | v18.72,46.18 19.23,46.18 19.24,46.19 | 7.27,25.74 24.89,25.74 30.96,25.74 | C13.2 38.37,76.2 | 31.32,80.8 31.15,80.8 25.19,80.8 24.2,79.46 24.2,76.9 26.09,75 C17.A | 31.32,80.81 33.16,80.81 35.23,80.48 v37.7,80.49 38.76,80.49 C20.1 | U5.5 31.26,80.7 | v60.71,19.72 57.61,19.72 | 61.38,24.24 61.38,31.86 | 61.38,31.86 61.38,36.3 61.76,36.34 | 58.07,32.16 60.92,32.19 61.38,31.86 | JP11.2 v67.93,6.46
  Bottom 0.305: v39.55,68.42 39.55,68.41 43.18,64.77 JP13.4 43.43,64.52 44.61,63.51 44.61,56.66 v42.75,54.55 | 27.56,50.67 JP19.1 27.56,50.49 | v67.93,6.46 67.86,6.64
  Bottom 0.61: 3.36,23.03 JP20.1
  Bottom 1.016: v37.67,78.17 v37.7,80.49 | v3.39,11.64 3.36,23.03 | v32.97,65.11 32.92,57.63 32.59,57.3 27.56,52.27 27.56,50.67 | 27.56,50.49 27.57,46.24 | 27.57,46.24 v27.57,46.19 | v27.57,46.19 v27.59,40.1 | v27.57,46.19 27.57,46.24 | 18.74,46.16 18.74,40.25 v18.88,40.1 | 67.86,6.64 67.86,12.57 v60.71,19.72
AREF
  Top 0.178: C2.2 22.86,38.45 25.65,38.45 U1.20
BT_CS
  Top 0.178: MODUL1.23 69.94,64.47 72.99,64.47 73.25,64.72 73.25,66.25 73.25,66.32 73.25,70.08 71.73,71.6 71.71,71.6 70.84,72.47 70.85,75.41 70.17,76.48 58.35,76.46 52.27,79.48 JP1.5 52.32,79.5
BT_CTS
  Top 0.178: SJ2.1 72.23,56.09 69.94,56.09 MODUL1.16
BT_MISO  (via drill 0.6)
  Top 0.178: MODUL1.24 59.91,65.79 v59.87,65.75 | v54.93,74.59 JP1.1
  Bottom 0.178: v59.87,65.75 58.89,65.75 58.52,66.12 58.52,66.13 57.27,66.84 55.84,66.84 55.04,68.18 55.04,74.48 v54.93,74.59
BT_MOSI
  Top 0.178: MODUL1.2 56.54,64.72 56.16,64.89 51.02,64.86 49.96,65.25 45.52,65.25 43.92,63.65 42.85,63.65 42.32,64.19 42.32,66.67 42.85,66.67 43.38,67.21 43.38,70.41 47.3,70.41 50.85,73.97 50.85,76.99 49.78,76.99 JP1.4
BT_ON#  (via drill 0.33)
  Top 0.178: R21.1 42.42,69.6 42.42,68.07 TP11.1 42.42,67.66 37.97,67.66 37.08,66.77 37.08,64.01 28.96,55.88 25.91,55.88 v22.86,52.83 | v23.62,33.78 27.18,33.78 U1.25
  Bottom 0.178: v23.62,33.78 22.86,34.54 v22.86,52.83
BT_ON_G
  Top 0.178: 42.67,71.12 R21.2 42.42,71.37 | 43.94,71.12 R22.1
  Top 0.305: R21.2 39.69,71.12 38.66,70.09 38.66,69.85 38.42,69.61 37.71,69.61 Q2.P1 | 42.67,71.12 44.11,71.12 R22.1 C19.1 | C19.1
BT_RESET
  Top 0.178: MODUL1.5 56.48,60.91 54.7,60.91 TP1.1
BT_RTS
  Top 0.178: SJ2.2 72.23,55.07 69.94,55.07 MODUL1.15
BT_SCK  (via drill 0.33)
  Top 0.178: v54.59,59.74 56.54,59.74 MODUL1.6
  Bottom 0.178: v54.59,59.74 53.34,60.98 53.34,75.92 52.27,76.99 JP1.3
BT_UARTRX  (via drill 0.6)
  Top 0.178: R2.2 49.87,62.69 52.07,60.48 52.07,57.55 v54.37,55.24 | v58.34,55.24 65.17,55.24 67.87,52.55 69.74,52.55 MODUL1.13
  Bottom 0.178: v54.37,55.24 v58.34,55.24
BT_UARTTX  (via drill 0.6)
  Top 0.178: R3.2 49.91,64.39 52.7,61.59 52.7,58.26 v54.37,56.59 | v58.34,56.52 65.88,56.52 68.58,53.82 69.76,53.82 MODUL1.14
  Bottom 0.178: v54.37,56.59 58.26,56.59 v58.34,56.52
BT_VCC  (via drill 0.33)
  Top 0.305: 49.53,74.42 JP1.2 | 68.17,47.2 69.56,47.2 TP12.1 | 68.17,47.2 67.66,47.2 C5.2 | 68.17,47.2 68.17,50.75 65.37,53.55 56.74,53.55 MODUL1.11 56.56,53.82 | Q2.P3 38.66,71.43 38.66,71.44 | v48.01,30.05 48.01,27.74 S1.4 | v49.43,31.65 49.25,31.65 48.18,32.72 S1.3
  Top 0.61: 38.66,71.41 38.66,71.44 38.66,72.02 39,72.28 48.26,72.28 49.53,74.42 | v52.63,53.82 56.56,53.82
  Bottom 0.305: 49.78,74.42 JP1.2 | 69.88,47.83 TP12.1 | 51.05,66.22 51.05,66.1 | 52.63,53.9 v52.63,53.82 52.45,53.7 52.45,34.49 49.52,31.56 | 49.52,31.56 v48.01,30.05 | v49.43,31.65 49.52,31.56
  Bottom 0.61: 49.78,74.42 51.05,71.8 51.05,66.22 | 51.05,66.1 52.63,64.53 52.63,53.9
BUZZER  (via drill 0.33)
  Top 0.178: v16.51,35.31 25.65,35.31 U1.24 | v34.07,21.76 v34.06,21.76 32.73,20.88 27.78,20.86 17.88,20.86 JP20.6
  Bottom 0.178: v16.51,35.31 16.26,35.05 16.26,24.64 JP20.6 | v34.07,21.76 34.04,21.84 37.08,24.89 JP16.1
BUZZER_DP
  Top 0.178: R20.1 39.62,20.83 39.62,24.89 JP16.2
CH_L1
  Top 0.305: R12.1 6.46,80.72 LED3.A
CHG_L_2  (via drill 0.33)
  Top 0.178: v26.42,62.99 26.42,63.75 U4.P15 | LED3.K v6.07,71.3 | v19.01,60.36 19.55,60.35 20.17,59.73 v23.48,59.73
  Bottom 0.178: v26.42,62.99 25.66,62.23 25.66,60.49 24.89,59.73 v23.48,59.73 | v6.07,71.3 6.07,71.33 6.07,61.91 7.62,60.35 v19.01,60.36
CHG_THR
  Top 0.178: U4.P18 27.43,65.79 28.01,65.79 29.79,64.01 R10.1
D1  (via drill 0.33)
  Top 0.178: v71.47,65.74 71.72,65.74 72.23,65.23 LED4.C | v71.47,67.77 71.72,68.02 72.23,68.02 R11.1
  Bottom 0.178: v71.47,67.77 v71.47,65.74
D4  (via drill 0.6)
  Top 0.178: U1.2 37.39,36.1 v37.42,36.07
  Bottom 0.178: v37.42,36.07 38.59,37.23 39.02,37.55 39.13,37.65 39.13,45.05 40.16,46.09 JP19.6
D5  (via drill 0.33)
  Top 0.178: v37.4,45.21 35.81,45.21 33.02,42.42 U1.9 | JP15.1 50.04,51.05 48.51,52.58 41.85,52.58 41.84,52.58 38.29,52.58 37.62,51.92 JP19.5
  Bottom 0.178: v37.4,45.21 37.4,48.2 37.78,48.58 37.78,50.48 JP19.5
D5_DP  (via drill 0.33)
  Top 0.178: JP15.2 53.14,48.3 v54.11,47.33 | v54.88,41.27 65.22,41.27 65.85,40.64 67.83,40.64 LED6.A
  Bottom 0.178: v54.11,47.33 54.11,42.04 v54.88,41.27
D7  (via drill 0.33)
  Top 0.178: v33.27,45.47 31.79,45.47 31.34,45.02 31.34,42.42 U1.11
  Bottom 0.178: v33.27,45.47 35.05,47.24 35.05,50.61 JP19.4
DTR
  Top 0.178: JP2.11 35.81,59.94 36.83,60.96 43.69,60.96 44.7,59.94 44.7,53.09 49.53,53.09 51.82,50.8 53.82,50.8 57.88,46.74 | JP17.1 57.88,46.74 | 57.88,46.74 57.88,46.69 56.12,44.93 56.12,44.35 C1.2
FT/OUT
  Top 0.178: U3.2 49.29,3.83 52.08,3.83 TP2.1
GND  (via drill 0.33, 0.6, 0.8)
  Top 0.305: 23.11,37.59 22.86,37.34 C2.1 | 23.11,37.59 25.65,37.59 U1.21 25.91,37.59 32.7,37.59 33.53,36.92 34.29,36.92 U1.3 34.54,36.92 35.56,36.92 36.58,38.1 C11.1 | C11.1 35.47,38.51 34.54,38.51 U1.5 | 46.1,38.35 C3.2 | 36.83,38.35 C11.1 | C4.2 46.2,40.55 47.31,39.43 46.99,39.05 | 44.2,69.85 R22.2 44.2,69.6 v45.72,66.39 56.36,65.79 MODUL1.1 | 56.48,65.74 MODUL1.1 | 60.04,51.85 59.36,52.53 56.74,52.53 MODUL1.12 56.48,52.78 56.23,52.72 51.73,52.71 50.88,53.55 50.88,59.63 49.53,59.63 48.51,59.69 JP2.1 48.26,59.94 45.97,59.94 JP2.3 | 60.04,51.85 60.04,51.96 65.36,51.96 66.14,51.18 66.14,49.99 MODUL1.28 66.39,49.74 66.39,47.2 C5.1 66.5,46.62 66.61,45.06 v66.57,45.07 66.57,45.09 66.56,45.1 | 60.04,51.85 60.04,49.99 MODUL1.29 | U3.8 49.29,11.45 49.29,10.43 U3.7 49.29,10.18 49.29,9.16 U3.6 49.29,8.91 49.29,7.89 U3.5 49.29,7.64 49.29,6.62 U3.4 49.03,6.37 41.56,6.39 | 41.56,6.39 41.54,4.35 40.56,3.94 39.57,3.94 39.64,4.08 U3.15 | 41.56,6.39 39.64,6.37 U3.13 39.64,6.62 39.64,7.64 U3.12 39.64,7.89 39.64,8.91 U3.11 39.64,9.16 39.64,10.18 U3.10 39.64,10.43 39.64,11.45 U3.9 38.67,11.55 37.08,13.4 | 16,14.73 15.75,14.99 U2.CD2 | JP10.6 25.2,9.65 25.17,9.65 23.63,11.19 23.63,15.63 23.5,15.76 | 2.52,16.76 5.59,18.8 R16.2 5.84,19.05 5.84,20.4 | 2.52,16.76 2.54,16.76 U2.GND2 | 2.52,14.73 4.32,13.97 4.83,13.97 5.08,13.72 U2.6 5.32,13.85 14.21,13.85 15.49,14.99 U2.CD2 | 2.52,16.76 2.52,14.73 | 2.52,14.73 1.52,14.73 1.52,3.56 U2.GND1 | 5.84,20.4 5.92,23.11 JP20.2 | 36.78,13.7 37.08,13.4 | 16,14.73 U2.CD2 | 35.18,74.96 33.78,74.96 C17.C 33.59,72.8 33.27,72.47 C18.2 32.48,70.66 31.91,70.1 31.32,70.1
  Top 0.305: 35.18,74.96 37.08,74.96 37.05,74.94 C13.1 | 35.18,74.96 35.16,77.42 C16.2 | U5.2 28.81,78.44 34.4,78.44 35.16,77.68 C16.2 | JP1.6 49.53,79.76 45.05,79.76 | C16.2 35.42,77.68 36.6,79.17 44.46,79.17 45.05,79.76 | 14.73,52.07 14.73,48.27 | 14.73,48.27 14.73,44.96 16.26,43.43 v20.32,43.43 22.1,43.43 22.35,43.18 C9.1 | 36.32,56.9 36.58,57.15 38.1,57.15 JP2.10 38.41,57.07 | 36.32,56.9 33.41,53.98 | 33.41,53.98 32,52.58 | 32,52.58 30.23,50.8 JP19.2 | 36.32,56.9 36.07,56.9 35.81,57.15 JP2.12 | C10.1 24.36,59.36 24.36,61.13 24.39,61.21 C15.C 24.13,61.47 22.1,61.47 C14.C | 29.94,70.1 31.32,70.1 | 29.94,70.1 27.94,70.1 R25.1 | 29.94,70.1 29.94,71.11 29.27,71.77 v28.63,71.77 | C6.C 22.1,69.6 22.13,69.61 22.1,71.79 23.28,71.77 v23.38,71.77 23.37,72.15 v23.37,74.86 | U4.EP 25.66,65.79 26.67,66.8 27.18,66.8 U4.P20 27.43,66.8 27.77,67.14 30.05,67.14 C7.2 29.98,67.31 31.32,67.31 | 14.73,52.07 26.42,52.07 26.92,52.58 32,52.58 | 46.99,39.05 46.35,38.42 45.77,38.42 C3.2 | 23.11,37.59 20.35,37.59 v20.32,37.62 | v24.93,65.09 25.15,65.28 25.4,65.53 U4.EP | v24.93,66.36 25.15,66.29 25.4,66.29 U4.EP | 47.24,36.27 47.24,36.07 38.86,36.07 36.83,38.1 C11.1 | 47.24,36.27 47.24,37.59 46.48,38.35 C3.2 | TP8.1 6.91,20.4 5.84,20.4 | R11.2 72.36,67.03 58.31,67.06 57.25,65.99 MODUL1.1 | 49.43,43.92 52.27,43.92 C8.1 | 49.43,43.92 48.72,43.92 R19.1 | 47.24,36.27 54.23,36.27 54.41,36.09 R13.1 56.91,38.47 v57.53,38.47 | 53.62,49.43 47.04,49.43 45.7,48.4 39.4,48.4 | 49.43,43.92 49.43,39.12 47.12,39.12 46.99,39.05 | 37.08,13.4 33.82,15.56 C12.1 33.8,15.76 23.5,15.76 | 41.56,6.39 41.54,7.08 v41.54,7.5 | v69.81,23.65 71.48,23.65 JCK2.P1
  Top 0.305: v69.82,35.56 71.12,35.56 JCK1.P1 66.4,35.75 v63.67,38.47 | 39.4,48.4 | 39.4,48.4 34.5,48.4 33.82,48.99 33.82,53.57 33.41,53.98 | 33.41,53.98 | 31.32,70.1 31.32,67.31 | 31.32,67.31 31.32,63.07 30.8,62.55 30.09,62.55 R10.2 | 14.73,52.07 14.73,54.37 | 14.73,54.37 14.72,54.33 17.08,54.33 18.07,54.33 R15.1 | 16,14.73 16,15.05 16.72,15.76 23.5,15.76 | 6.48,48.36 5.54,48.36 4.4,49.5 X2.GND | 6.48,48.36 6.68,48.36 | 6.68,48.36 v6.68,48.33 6.51,48.33 6.48,48.36 | R23.1 14.57,54.2 14.73,54.37 | 6.68,48.36 14.64,48.36 14.73,48.27 | LED1.K 4.27,57.15 3.06,58.36 3.06,62.72 4.84,64.51 10.24,64.51 X1.P4 | 45.05,79.76 45.05,80.49 43.03,80.49 C20.2
  Top 0.33: R9.2 60.58,79.36 58.5,81.44 51.42,81.44 JP1.6
  Top 0.406: v26.04,66.36 25.47,66.36 U4.EP | 66.57,45.09 65.55,45.09 R17.2 | C21.2 21.47,80.52 v21.59,80.64
  Top 0.61: 71.44,23.97 71.16,23.81 JCK2.P1 | v24.18,62.84 24.18,61.64 C15.C
  Bottom 0.305: JP2.3 45.72,59.94 45.72,64.26 v45.72,66.39 48.51,70.1 48.51,78.49 49.53,79.5 JP1.6 | v28.63,71.77 v23.38,71.77 | JP2.12 35.56,57.4 34.54,58.42 34.54,63.5 35.56,64.52 JP13.1 | v20.32,37.62 v20.32,43.43 | JP20.2 7.11,27.54 7.05,32.09 7.05,33.32 7.07,46.17 7.07,47.95 v6.68,48.33 | v41.54,7.5 44.3,7.5 BAT1.GND | v66.57,45.07 66.6,38.78 v69.82,35.56 69.82,33.48 68.85,32.51 68.85,30.7 69.83,29.72 v69.81,23.65 69.8,23.64 69.8,21.63 68.5,20.33 68.5,19.34 69.82,18.03 69.8,5.05 70.94,3.92 JP11.1 | v63.67,38.47 v57.53,38.47 | X1.P4 10.25,64.57 12.42,66.74 12.42,67.73 TP9.1 14.6,70 20.73,74.86 v23.37,74.86
  Bottom 0.406: v26.04,66.36 v26.04,65.09
  Bottom 0.61: v24.93,65.09 24.93,65.06 24.45,64.58 24.45,63.11 v24.18,62.84
  other vias: 11.76,78.93 10.31,78.94 11.75,74.99 10.28,74.97
  pour Top (isolate 0.254, rank 3): -3.18,-1.91 75.6,-1.91 75.6,3.66 75.57,3.66 75.57,84.2 -3.2,84.2 -3.2,-1.88
  pour Bottom (isolate 0.254, rank 3): -1.35,-0.62 76.47,-0.53 76.38,3.89 76.3,4.81 76.12,84.66 -2.88,84.57 -1.37,-0.59
HW_RX  (via drill 0.33, 0.6)
  Top 0.178: v34.04,32.77 31.66,32.77 31.42,33.01 31.42,33.78 U1.30 | R3.1 46.3,64.39 44.53,62.63 v40.8,62.63
  Bottom 0.178: v34.04,32.77 36.58,35.31 36.58,53.85 39.62,56.9 39.62,58.67 40.64,59.69 JP2.7 40.8,59.71 v40.8,62.63
HW_TX  (via drill 0.33, 0.6)
  Top 0.178: v32,35.31 32,34.04 U1.31 | R2.1 46.81,62.69 45.96,61.83 v38.26,61.83
  Bottom 0.178: v32,35.31 31.5,35.81 31.5,51.82 35.81,56.13 37.08,56.13 37.08,58.67 38.1,59.69 JP2.9 v38.26,61.83
INT0  (via drill 0.33, 0.6)
  Top 0.178: v45.2,34.15 33.61,34.15 32.94,34.12 U1.32 | v68.26,59.69 69.69,59.69 MODUL1.19 | v55.56,45.88 45.96,45.88 v45.24,46.56
  Bottom 0.178: 45.21,46.62 45.21,46.2 | 45.21,46.2 45.21,34.8 v45.2,34.15 45.34,34.14 | JP19.8 45.21,50.55 45.21,46.62 | LED2.A 69.1,77.94 70.22,77.05 70.22,60.21 69.67,59.66 68.56,59.66 68.3,59.69 | 68.3,59.69 60.88,59.68 59.21,57.87 59.21,53.87 55.6,50.43 55.6,45.92 v55.56,45.88 | 45.21,46.62 v45.24,46.56 45.32,46.31 45.21,46.2 | v68.26,59.69 68.31,59.69 68.3,59.69
INT1  (via drill 0.33)
  Top 0.178: 39.65,35.2 48.54,35.2 S2.1 | 39.65,35.2 34.49,35.2 U1.1 | S2.2 48.54,40.36 48.54,42.49 R19.2 48.54,42.67 46.23,44.98 43.03,44.98 v42.49,45.52 | v39.65,35.38 39.65,35.2
  Bottom 0.178: JP19.7 42.67,50.49 42.67,45.7 v42.49,45.52 41.6,44.63 41.6,37.34 v39.65,35.38
MISO  (via drill 0.33)
  Top 0.178: v25.62,41.95 26.92,41.91 27.18,42.16 U1.16 | v25.86,16.49 13.39,16.51 11.86,14.99 5.33,14.99 U2.7
  Bottom 0.178: v25.62,41.95 25.62,32.43 25.84,32.21 25.84,20.17 25.86,18.83 v25.86,16.49 25.88,15.36 25.88,14.55 25.89,13.35 30.16,9.4 30.16,5.89 27.74,4.57 JP10.1
MOSI  (via drill 0.33)
  Top 0.178: v25.15,43.43 27.94,43.43 27.94,42.42 U1.15 | U2.3 5.24,10.54 12.61,10.54 14.5,7.12 24.95,7.11 JP10.4
  Bottom 0.178: v25.15,43.43 24.89,43.18 24.89,41.4 25.15,41.15 25.13,12.82 26.3,11.64 26.32,8.26 JP10.4
N$1
  Top 0.178: R20.2 40.89,20.83 44.96,20.83 SG1.-
N$2
  Top 0.178: 40.64,55.12 SJ1.2 | 40.64,57.15 JP2.8 40.89,57.4 | 43.18,59.69 JP2.5
  Top 0.305: 40.64,57.15 40.64,55.12 | 40.89,57.4 43.18,59.69
N$3
  Top 0.178: U4.P19 27.43,66.29 29.72,66.29 29.98,66.04 C7.1
N$4
  Top 0.178: U4.P5 24.47,67.84 24.12,68.13 19.92,68.14 19.15,68.91 R24.2
N$5
  Top 0.178: 67.82,43.19 LED6.K
  Top 0.406: R17.1 67.05,42.54 LED6.K
N$6
  Top 0.178: U4.P2 25.99,67.56 25.99,68.83 26.42,68.83 R26.2
N$7
  Top 0.178: LED5.C 8.38,18.8 7.11,18.8 R16.1
N$8
  Top 0.406: R9.1 67.63,80.66 LED2.K
N$9
  Top 0.406: R6.1 LED1.A
N$10
  Top 0.178: C16.1 33.89,77.68 31.35,77.68 U5.4
N$11
  Top 0.178: U4.P3 25.48,67.56 25.48,69.85 26.42,69.85 R25.2
N$14
  Top 0.178: X2.D- R5.2
N$16
  Top 0.178: X2.D+ 5.5,50.8 6.14,50.15 R5.1
PIO3
  Top 0.178: MODUL1.20 69.94,60.91 69.56,60.98 71.85,60.98 TP4.1
PIO4  (via drill 0.33)
  Top 0.178: R13.2 54.59,34.85 55.47,35.74 56.36,35.74 TP10.1 | v53.52,29.34 51.92,27.74 S1.2 | v53.16,31.83 52.81,31.83 51.92,32.72 S1.1 | v63.12,57.25 68.74,63.25 69.32,63.25 69.7,63.3 MODUL1.22
  Bottom 0.178: 54.59,30.4 56.36,32.18 56.36,35.74 TP10.1 56.54,35.92 56.54,50.67 v63.12,57.25 | 54.59,30.4 v53.52,29.34 | 54.59,30.4 v53.16,31.83
PIO5
  Top 0.178: 72.48,62.18 72.48,63.45 LED4.A | 72.48,62.18 69.94,62.18 MODUL1.21 | 72.48,62.18 TP7.1
PIO6
  Top 0.178: MODUL1.3 56.48,63.45 56.23,63.71 54.7,63.71 TP6.1
PIO7
  Top 0.178: MODUL1.4 56.48,62.18 54.7,62.18 TP5.1
PIO8
  Top 0.178: JP17.2 61.34,46.74 61.44,46.83 61.44,49.64 MODUL1.31
RESET  (via drill 0.33)
  Top 0.178: v30.64,35.05 30.48,34.04 U1.29 | v22.1,47.75 41.78,47.75 44.02,45.52 53.52,45.52 56.01,43.03 C1.1 | 23.54,23.11 R4.1 | 28.87,23.11 v30.66,23.12 28.87,23.11 23.54,23.11 | JP20.8 23.54,23.11
  Bottom 0.178: v30.64,35.05 30.66,24.36 v30.66,23.12 30.97,14.79 33.47,12.43 JP9.1 | v22.1,47.75 21.34,46.99 21.34,23.34 JP20.8
SCK  (via drill 0.33)
  Top 0.178: 10.16,18.54 LED5.A | v24.38,40.97 25.65,40.89 U1.17 | 5.4,12.76 5.33,12.45 U2.5 | 10.16,18.54 24.35,18.54 v24.36,18.53 | v24.98,11.48 24.98,11.46 26.33,10.11 26.33,8.42 JP10.3 | 10.16,18.54 v7.31,15.69 | v7.22,12.76 U2.5 | U2.5
  Bottom 0.178: v24.38,40.97 24.38,22.35 v24.36,18.53 24.36,18.37 | 24.36,18.37 | 24.36,18.37 24.36,12.1 v24.98,11.48 | v7.31,15.69 7.31,12.85 v7.22,12.76
SCL  (via drill 0.33, 0.6)
  Top 0.178: 29.81,33.78 U1.28 29.87,33.78 29.87,32.31 30.18,32 v33.07,32 | v27.98,67.82 26.52,67.82 26.48,67.77 26.48,67.56 U4.P1 | v25.6,50.14 27.38,48.36 v32.72,48.36 | 32.89,30.4 31.47,30.4 R8.1 | v47.43,2.71 47.49,2.72 49.06,2.74 U3.1 | v58.29,25.93 58.08,25.72 45.96,25.72 41.27,30.4 41.27,30.48 33.1,30.48 33.07,30.4 32.89,30.4 | 32.89,30.4 v33.07,30.58 | v39.55,15.6 39.59,15.57 57.49,15.59 64.09,8.99 64.09,9 JP11.3
  Bottom 0.178: v27.98,67.82 27.05,67.39 27,56.44 25.61,55.17 25.61,50.26 v25.6,50.14 | v32.72,48.36 32.54,48.18 32.54,41.6 33.07,41.07 v33.07,32 v33.07,30.58 33.25,30.4 33.25,20.98 v39.55,15.6 39.83,15.38 47.45,10.7 47.45,4.3 v47.43,2.71 | v58.29,25.93 58.17,25.81
SD_SS  (via drill 0.33)
  Top 0.178: v16.35,44.67 28.59,44.67 28.96,43.76 28.96,42.42 U1.14 | U2.2 5.76,9.48 6.01,9.41 6.34,9.08 6.59,8.76 6.6,2.29 TP3.1
  Bottom 0.178: v16.35,44.67 16.35,41.17 16.35,40.29 9.65,33.02 9.65,5.08 6.86,2.29 TP3.1
SDA  (via drill 0.33)
  Top 0.178: 28.96,33.78 U1.27 | v28.12,64.72 27.59,65.25 27.41,65.25 U4.P17 | v28.27,35.03 28.8,34.49 28.8,33.96 U1.27 | R7.1 29.16,30.4 29.16,33.78 28.98,33.78 U1.27 | v31.48,10.9 34.93,10.89 37.74,2.57 38.63,2.57 39.28,2.74 U3.16 | v27.5,16.51 28.56,16.47 43.7,16.45 58.86,16.45 63.77,11.54 JP11.4
  Bottom 0.178: v28.12,64.72 27.59,64.19 27.59,55.57 26.33,54.31 26.31,36.98 v28.27,35.03 27.48,32.81 27.48,17.78 v27.5,16.51 27.46,17.73 27.46,16.79 27.54,16.24 27.54,14.1 v31.48,10.9
SPI_SS  (via drill 0.33)
  Top 0.178: v18.54,28.22 v26.59,28.2 | v26.59,28.2 26.84,28.19 | 26.84,28.19 28.18,29.53 28.18,33.78 U1.26 | JP9.3 31.47,7.1 v30.91,7.66 | v26.59,28.2 26.84,28.2 26.84,28.19
  Bottom 0.178: v18.54,28.22 18.56,26.18 18.56,24.4 JP20.7 18.54,23.04 | v30.91,7.66 30.91,9.97 26.59,14.02 v26.59,28.2 | v26.59,28.2
SS
  Top 0.178: JP10.5 27.74,9.65 33.22,9.63 JP9.2
SS1  (via drill 0.33)
  Top 0.178: v15.49,35.31 16.26,36.07 25.65,36.07 U1.23
  Bottom 0.178: v15.49,35.31 13.48,33.45 13.48,24.56 JP20.5
SW_RX  (via drill 0.33)
  Top 0.178: v38.67,46.23 31.26,46.23 30.57,45.54 30.57,42.42 U1.12
  Bottom 0.178: v38.67,46.23 38.8,46.99 38.8,53.09 43.18,57.15 JP2.6
SW_TX  (via drill 0.33)
  Top 0.178: v40.89,46.99 30.55,46.99 29.73,46.17 29.73,42.42 U1.13
  Bottom 0.178: v40.89,46.99 41.46,47.78 41.41,52.2 45.88,54.74 JP2.4
VBAT  (via drill 0.33, 0.6)
  Top 0.178: 18.02,55.82 R14.2 | 25.4,63.88 U4.P13 | 26.5,61.45 26.67,61.45 | 26.67,61.45 C15.A | 26.77,61.21 26.77,61.35 26.67,61.45 | U4.P4 25,67.55 25,74.51 23.32,76.19 19.6,76.19 v19.58,76.21
  Top 0.305: 26.77,59.44 C10.2 26.67,59.18 | v22.91,5.84 29.37,5.84 31,4.21 33.73,1.48 41.67,1.48 44.67,5.2 47.94,5.2 48.32,5.18 U3.3 | U4.P12 U4.P13 U4.P14 | v16.79,55.97 R14.2
  Top 0.61: 26.77,61.21 26.77,59.44 | 26.67,59.18 26.67,58.5 26.08,57.91 25.04,57.91 22.02,57.91 21.96,57.92 18.16,57.92 | 26.5,61.45 25.4,62.87 25.4,63.88 | JP14.2 16.68,75.2 16.68,70.27 18.15,68.81 18.15,61.64 18.14,61.64 18.16,57.92 | 18.16,57.92 18.16,55.97 R14.2
  Bottom 0.178: v19.58,76.21 17.64,76.21 JP14.2
  Bottom 0.305: v22.91,5.84 17.3,5.84 17.3,9 16.64,9.65 16.64,14.82 17.18,15.36 17.22,50.96 17.22,55.53 v16.79,55.97
  pour Top (no thermals): 27.67,60.84 26.67,60.84 26.67,61.55
VBAT_ADC  (via drill 0.33)
  Top 0.178: v16.48,38.92 21.61,38.9 21.94,39.23 v23.62,39.23 25.65,39.37 U1.19 | R15.2 23.65,54.4 v23.65,54.49
  Top 0.305: R14.1 R15.2
  Bottom 0.178: v16.48,38.92 10.94,33.24 10.94,23.84 JP20.4 | v23.62,39.23 23.65,39.45 v23.65,54.49
VBAT_RTC  (via drill 0.33)
  Top 0.178: v37.86,5.35 39.38,5.35 U3.14
  Bottom 0.178: v37.86,5.35 36.89,6.59 36.89,7.35 BAT1.PWR@1
VBUS  (via drill 0.6)
  Top 0.305: 3.91,52.52 X2.VBUS | 11.14,59.39 10.96,59.39 | R18.2 9.88,54.22 9.28,54.81 9.28,54.9 8.62,55.57
  Top 0.406: X1.P1 16.25,64.5 | R6.2 10.66,59.69 10.96,59.39
  Top 0.61: 21.79,66.53 C6.A
  Top 1.016: 16.25,64.5 11.14,59.39 11.14,58.09 8.62,55.57 5.57,52.52 3.91,52.52 | 21.79,66.53 19.73,66.53 v19.69,66.58
  Bottom 0.61: 19.7,71.37 19.71,71.45 | 38.1,64.77 JP13.2
  Bottom 1.016: 19.7,71.37 19.71,69.52 19.71,67.8 19.71,66.6 v19.69,66.58 18.31,66.58 X1.P1 | 19.71,71.45 21.3,73.05 29.44,73.06 31.05,71.6 31.65,68.92 32.24,68.18 35.8,68.18 36.91,66.67 38.1,64.77
  pour Top (no thermals): 21.07,67.25 23.17,67.25 23.67,66.75 23.67,65.75 23.47,65.75 23.17,66.05 21.07,66.05
VSYS  (via drill 0.33, 0.8)
  Top 0.305: v28.91,68.85 28.82,68.85 27.94,68.83 R26.1 | v23.31,63.82 23.62,63.55 | 21.72,63.48 C14.A | R12.2 12.45,80.73 21.06,73.56 v21.06,70.97 19.05,70.93 R24.1
  Top 0.406: 21.72,63.48 21.75,63.48 21.75,64.22
  Top 0.61: 2.85,30.31 S3.3 | 23.13,64.21 23.28,64.37
  Top 1.016: 2.85,30.31 3.99,30.31 5.55,31.15 5.55,40.44 5.55,42.35 5.55,43.17 6.97,44.58 12.77,44.58 v12.79,44.6 | v19.68,64.21 21.75,64.22 23.13,64.21
  Bottom 0.305: v23.31,63.82 23.28,63.79 23.36,69.33 23.36,70.79 | 23.36,70.79 26.92,70.81 28.28,70.81 28.91,70.81 v28.91,68.85 | v21.06,70.97 21.47,70.8 23.36,70.79
  Bottom 1.016: v19.68,64.21 19.68,61.4 20.14,60.94 20.14,59.64 19,58.51 15.06,58.51 12.79,56.23 v12.79,44.6
  pour Top (no thermals): 23.67,65.25 23.07,65.25 22.57,64.75 21.17,64.75 21.17,63.55 24.27,63.55 24.47,63.74 24.47,64.05 24.27,64.05 23.67,64.64
VSYS_SW  (via drill 0.6, 0.8)
  Top 0.406: U5.1 | v26.61,77.45 26.56,77.82 26.58,77.33 | 28.37,77.33 U5.3 | C21.1 19.56,79.25 v19.05,78.74
  Top 0.61: 27.67,79.45 U5.1
  Top 1.016: 27.67,79.45 26.58,79.11 26.58,77.33 28.37,77.33
  Bottom 0.406: JP13.3 40.8,64.73 40.8,64.77 | v19.05,78.74 19.05,77.44 | 19.05,77.44
  Bottom 0.61: 40.8,64.77 40.8,65.79 28.1,76.04 v26.61,77.45 | 5.54,34.08 5.06,34.13 | 2.92,33.36 S3.2
  Bottom 1.016: 5.54,34.08 5.52,40.17 1.14,44.31 1.13,48.32 1.1,74.35 12.36,77.43 19.05,77.44 v26.61,77.45 | 5.06,34.13 4.46,33.29 2.92,33.36
WALL  (via drill 0.33)
  Top 0.178: v8.54,36.58 23.37,36.58 23.62,36.83 25.65,36.83 U1.22 | v8.55,52.76 9.79,52.76 R18.1 11.27,52.92 R23.2
  Bottom 0.178: 8.56,36.58 8.57,36.58 8.57,25.32 8.4,24.64 JP20.3 | 8.56,36.59 v8.55,52.76
  Bottom 0.305: v8.54,36.58 8.56,36.58 8.56,36.59
XTAL1
  Top 0.178: 45.47,37.08 C3.1 45.72,37.08 | 36.07,40.39 35.81,40.13 34.54,40.13 U1.7
  Top 0.203: 36.07,40.39 41.53,40.39 42.55,39.37 42.55,37.05 Y1.1 45.63,37.03 C3.1
XTAL2
  Top 0.178: C4.1 45.47,41.91 42.67,41.91 Y1.2 42.42,41.66 35.53,41.66 35.02,41.15 U1.8

### Text on the board
tPlace: BT_CS | GND | BT_SCK | BT_MOSI | BT_VCC | VSYS_SW | GND | VBUS | 3V3 | DTR | HW_TX | HW_RX | GND | GND | N/C | GND | GND | SW_RX | SW_TX | 3V3 | GND | 1WB | D7 | D5 | D4 | INT1 | INT0 | FoneAstra v1.6 | GND | WALL | VBAT_ADC | 3V3 | SS1 | SPI_SS | RESET | BUZZER | GND | SDA | SS | SCL | RESET/PGM | MOSI | SCK | SPI_SS | 3V3 | 3V3 | MISO | GND
tDocu: BT_MISO